# EAGLE design KMB-20 (EAGLE 8.7.1)

## Sheet 1 of 4: Avionics
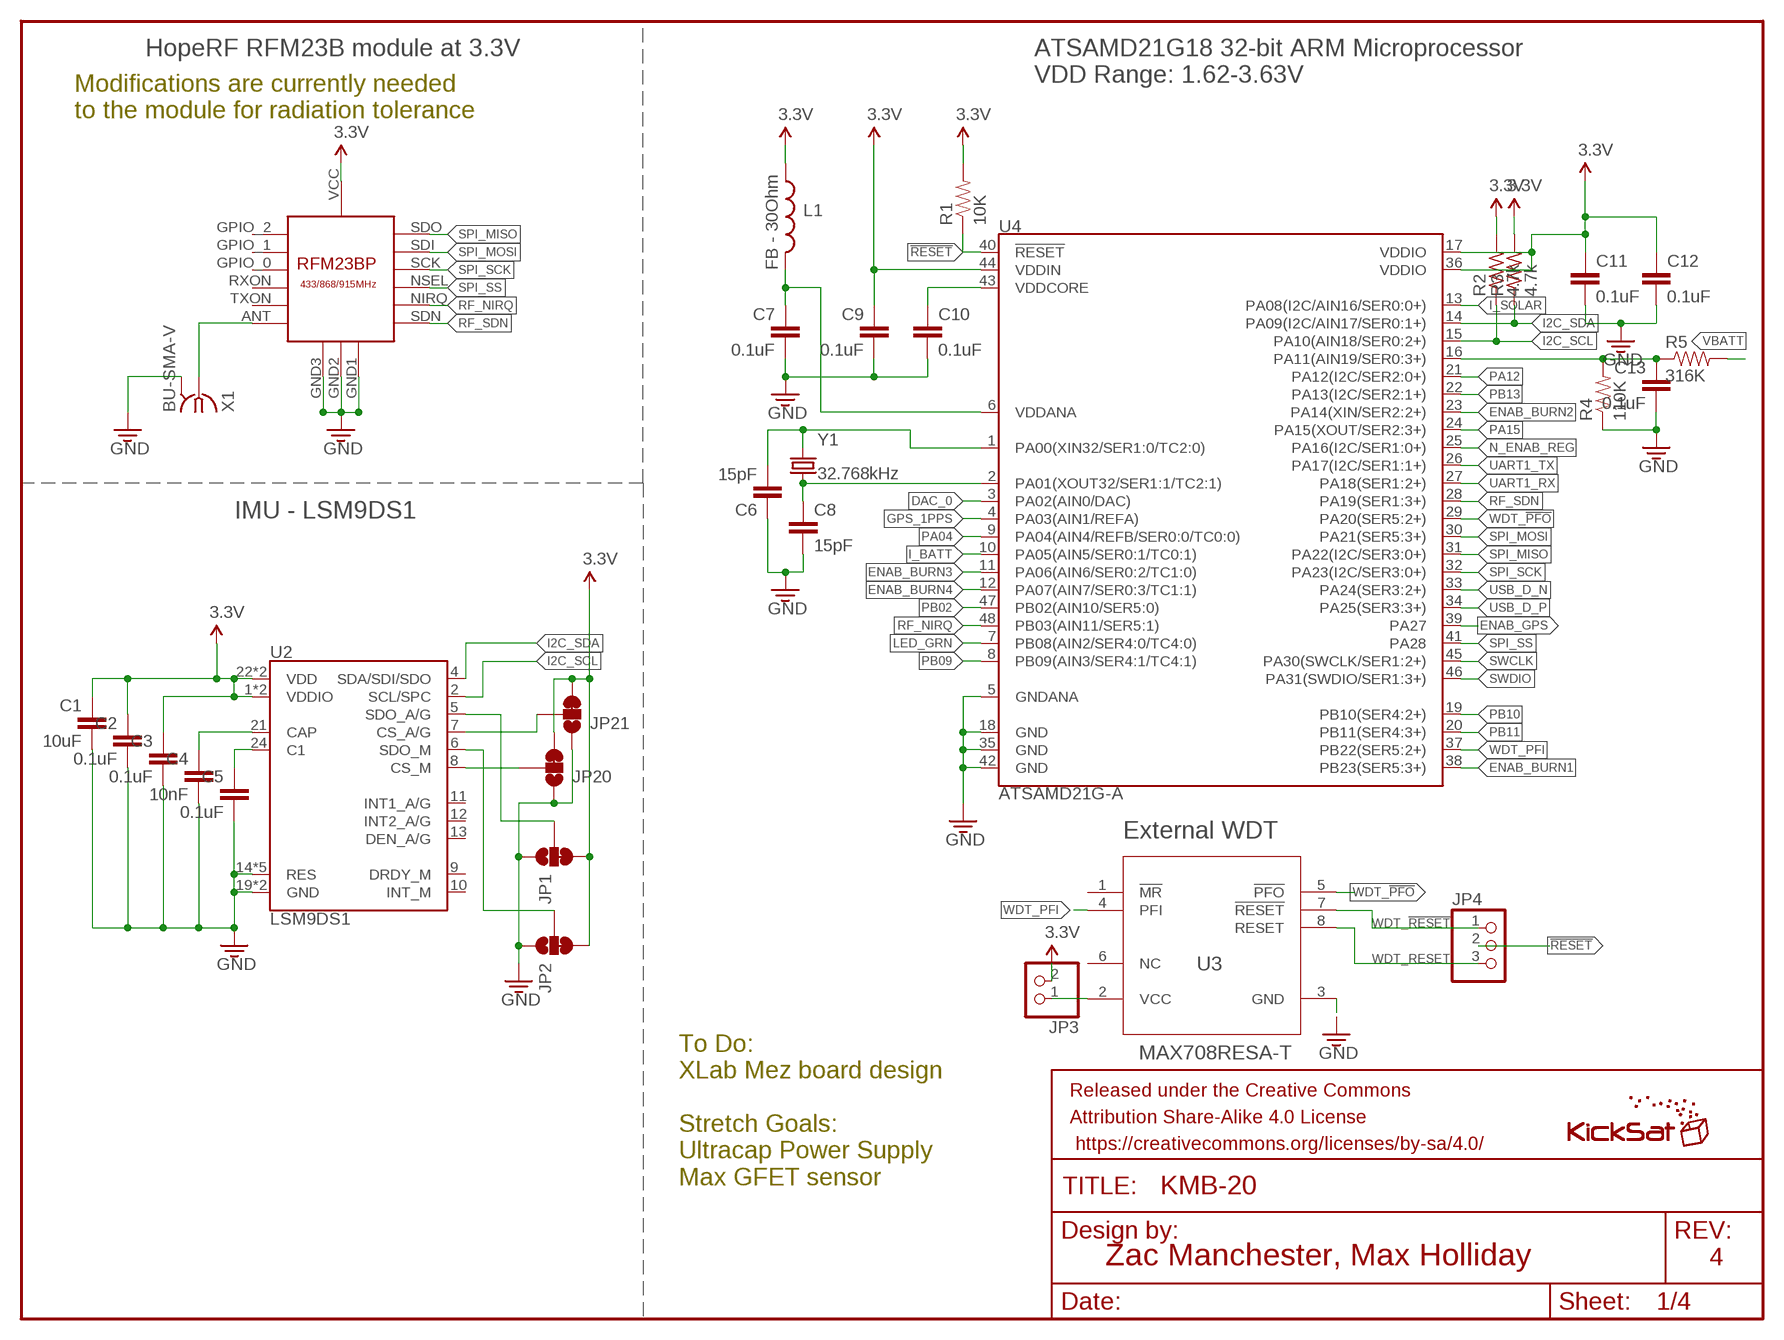
[diagram p0: schematic, sheet 1]

### Parts
C1  10uF  10UF-6.3V-20%(0603)  [0603-CAP]
C2  0.1uF  0.1UF-25V(+80/-20%)(0603)  [0603-CAP]
C3  0.1uF  0.1UF-25V(+80/-20%)(0603)  [0603-CAP]
C4  10nF  10NF/10000PF-50V-10%(0603)  [0603-CAP]
C5  0.1uF  0.1UF-25V(+80/-20%)(0603)  [0603-CAP]
C6  15pF  15PF-50V-5%(0603)  [0603-CAP@1]
C7  0.1uF  0.1UF-25V(+80/-20%)(0603)  [0603-CAP]
C8  15pF  15PF-50V-5%(0603)  [0603-CAP@1]
C9  0.1uF  0.1UF-25V(+80/-20%)(0603)  [0603-CAP]
C10  0.1uF  0.1UF-25V(+80/-20%)(0603)  [0603-CAP]
C11  0.1uF  0.1UF-25V(+80/-20%)(0603)  [0603-CAP]
C12  0.1uF  0.1UF-25V(+80/-20%)(0603)  [0603-CAP]
C13  0.1uF  0.1UF-25V(+80/-20%)(0603)  [0603-CAP]
FRAME1  FRAME-LETTER  [CREATIVE_COMMONS]
JP1  JUMPER-PAD-3-2OF3_NC_BY_TRACE_SMALL  [PAD-JUMPER-3-2OF3_NC_BY_TRACE_YES_SILK_FULL_BOX]
JP2  JUMPER-PAD-3-2OF3_NC_BY_TRACE_SMALL  [PAD-JUMPER-3-2OF3_NC_BY_TRACE_YES_SILK_FULL_BOX]
JP3  PINHD-1X2  [1X02]
JP4  PINHD-1X3  [1X03]
JP20  JUMPER-PAD-3-2OF3_NC_BY_TRACE_SMALL  [PAD-JUMPER-3-2OF3_NC_BY_TRACE_YES_SILK_FULL_BOX]
JP21  JUMPER-PAD-3-2OF3_NC_BY_TRACE_SMALL  [PAD-JUMPER-3-2OF3_NC_BY_TRACE_YES_SILK_FULL_BOX]
L1  FB - 30Ohm  INDUCTOR0603  [0603]
L2  KICKSAT_LOGO  [KICKSAT_LOGO]
R1  10K  10KOHM-1/10W-1%(0603)0603  [0603-RES]
R2  4.7k  R-US_R0603  [R0603]
R3  4.7k  R-US_R0603  [R0603]
R4  110K  10KOHM-1/10W-1%(0603)0603  [0603-RES]
R5  316K  10KOHM-1/10W-1%(0603)0603  [0603-RES]
U1  RFM23BP  [RFM23BP]
U2  LSM9DS1  [LGA24-8X4]
U3  MAX708RESA-T  [SO8]
U4  ATSAMD21G-A  [TQFP-48]
X1  BU-SMA-V  [BU-SMA-V]
Y1  32.768kHz  CRYSTAL3.2X1.5MM  [CRYSTAL-SMD-3.2X1.5MM]

### Nets
3.3V: C1.1 C2.1 C3.1 C9.1 C11.1 C12.1 JP1.3 JP2.3 JP3.2 JP20.3 JP21.3 L1.1 R1.2 R2.2 R3.2 U1.VCC U2.1(VDDIO) U2.3(VDDIO) U2.22(VDD) U2.23(VDD) U4.17(VDDIO) U4.36(VDDIO) U4.44(VDDIN) ; also sheet 2,3,4
!RESET: JP4.2 R1.1 U4.40(!RESET!) ; also sheet 3
DAC_0: U4.3(PA02(AIN0/DAC)) ; also sheet 4
ENAB_BURN1: U4.38(PB23(SER5:3+)) ; also sheet 3
ENAB_BURN2: U4.23(PA14(XIN/SER2:2+)) ; also sheet 3
ENAB_BURN3: U4.11(PA06(AIN6/SER0:2/TC1:0)) ; also sheet 3
ENAB_BURN4: U4.12(PA07(AIN7/SER0:3/TC1:1)) ; also sheet 3
ENAB_GPS: U4.39(PA27) ; also sheet 2
GND: C1.2 C2.2 C3.2 C4.2 C5.2 C6.1 C7.2 C8.2 C9.2 C10.2 C11.2 C12.2 C13.2 JP1.1 JP2.1 JP20.1 JP21.1 R4.1 U1.GND1 U1.GND2 U1.GND3 U2.14(RES) U2.15(RES) U2.16(RES) U2.17(RES) U2.18(RES) U2.19(GND) U2.20(GND) U3.3(GND) U4.5(GNDANA) U4.18(GND) U4.35(GND) U4.42(GND) X1.2 X1.3 X1.4 X1.5 ; also sheet 2,3,4
GPS_1PPS: U4.4(PA03(AIN1/REFA)) ; also sheet 4
I2C_SCL: R2.1 U2.2(SCL/SPC) U4.15(PA10(AIN18/SER0:2+)) ; also sheet 4
I2C_SDA: R3.1 U2.4(SDA/SDI/SDO) U4.14(PA09(I2C/AIN17/SER0:1+)) ; also sheet 4
I2C_SDOA/G: JP1.2 U2.5(SDO_A/G)
I_BATT: U4.10(PA05(AIN5/SER0:1/TC0:1)) ; also sheet 2
I_SOLAR: U4.13(PA08(I2C/AIN16/SER0:0+)) ; also sheet 2
LED_GRN: U4.7(PB08(AIN2/SER4:0/TC4:0)) ; also sheet 4
N$2: C4.1 U2.21(CAP)
N$6: C5.1 U2.24(C1)
N$8: JP3.1 U3.2(VCC)
N$18: C7.1 L1.2 U4.6(VDDANA)
N$19: U1.ANT X1.1
N$21: JP2.2 U2.6(SDO_M)
N$23: JP20.2 U2.8(CS_M)
N$26: JP21.2 U2.7(CS_A/G)
N$28: C6.2 U4.1(PA00(XIN32/SER1:0/TC2:0)) Y1.P$2
N$29: C8.1 U4.2(PA01(XOUT32/SER1:1/TC2:1)) Y1.P$1
N$40: C13.1 R4.2 R5.1 U4.16(PA11(AIN19/SER0:3+))
N_ENAB_REG: U4.25(PA16(I2C/SER1:0+)) ; also sheet 2
PA04: U4.9(PA04(AIN4/REFB/SER0:0/TC0:0))
PA12: U4.21(PA12(I2C/SER2:0+)) ; also sheet 4
PA15: U4.24(PA15(XOUT/SER2:3+))
PB02: U4.47(PB02(AIN10/SER5:0)) ; also sheet 4
PB09: U4.8(PB09(AIN3/SER4:1/TC4:1)) ; also sheet 4
PB10: U4.19(PB10(SER4:2+)) ; also sheet 4
PB11: U4.20(PB11(SER4:3+)) ; also sheet 4
PB13: U4.22(PA13(I2C/SER2:1+))
RF_NIRQ: U1.NIRQ U4.48(PB03(AIN11/SER5:1))
RF_SDN: U1.SDN U4.28(PA19(SER1:3+))
SPI_MISO: U1.SDO U4.31(PA22(I2C/SER3:0+))
SPI_MOSI: U1.SDI U4.30(PA21(SER5:3+))
SPI_SCK: U1.SCK U4.32(PA23(I2C/SER3:0+))
SPI_SS: U1.NSEL U4.41(PA28)
SWCLK: U4.45(PA30(SWCLK/SER1:2+)) ; also sheet 3
SWDIO: U4.46(PA31(SWDIO/SER1:3+)) ; also sheet 3
UART1_RX: U4.27(PA18(SER1:2+)) ; also sheet 4
UART1_TX: U4.26(PA17(I2C/SER1:1+)) ; also sheet 4
USB_D_N: U4.33(PA24(SER3:2+)) ; also sheet 3
USB_D_P: U4.34(PA25(SER3:3+)) ; also sheet 3
VBATT: R5.2 ; also sheet 2,3
VDDCORE3: C10.1 U4.43(VDDCORE)
WDT_!PFO: U3.5(!PFO) U4.29(PA20(SER5:2+))
WDT_!RESET: JP4.1 U3.7(!RESET)
WDT_PFI: U3.4(PFI) U4.37(PB22(SER5:2+))
WDT_RESET: JP4.3 U3.8(RESET)
Unconnected: U1.GPIO_0 U1.GPIO_1 U1.GPIO_2 U1.RXON U1.TXON U2.9(DRDY_M) U2.10(INT_M) U2.11(INT1_A/G) U2.12(INT2_A/G) U2.13(DEN_A/G) U3.1(!MR) U3.6(NC)

### Notes on the sheet
- HopeRF RFM23B module at 3.3V
- ATSAMD21G18 32-bit ARM Microprocessor 
  VDD Range: 1.62-3.63V
- Modifications are currently needed
  to the module for radiation tolerance
- IMU - LSM9DS1
- External WDT
- To Do:
  XLab Mez board design
  
  Stretch Goals:
  Ultracap Power Supply
  Max GFET sensor
- Zac Manchester, Max Holliday | 4

## Sheet 2 of 4: Power
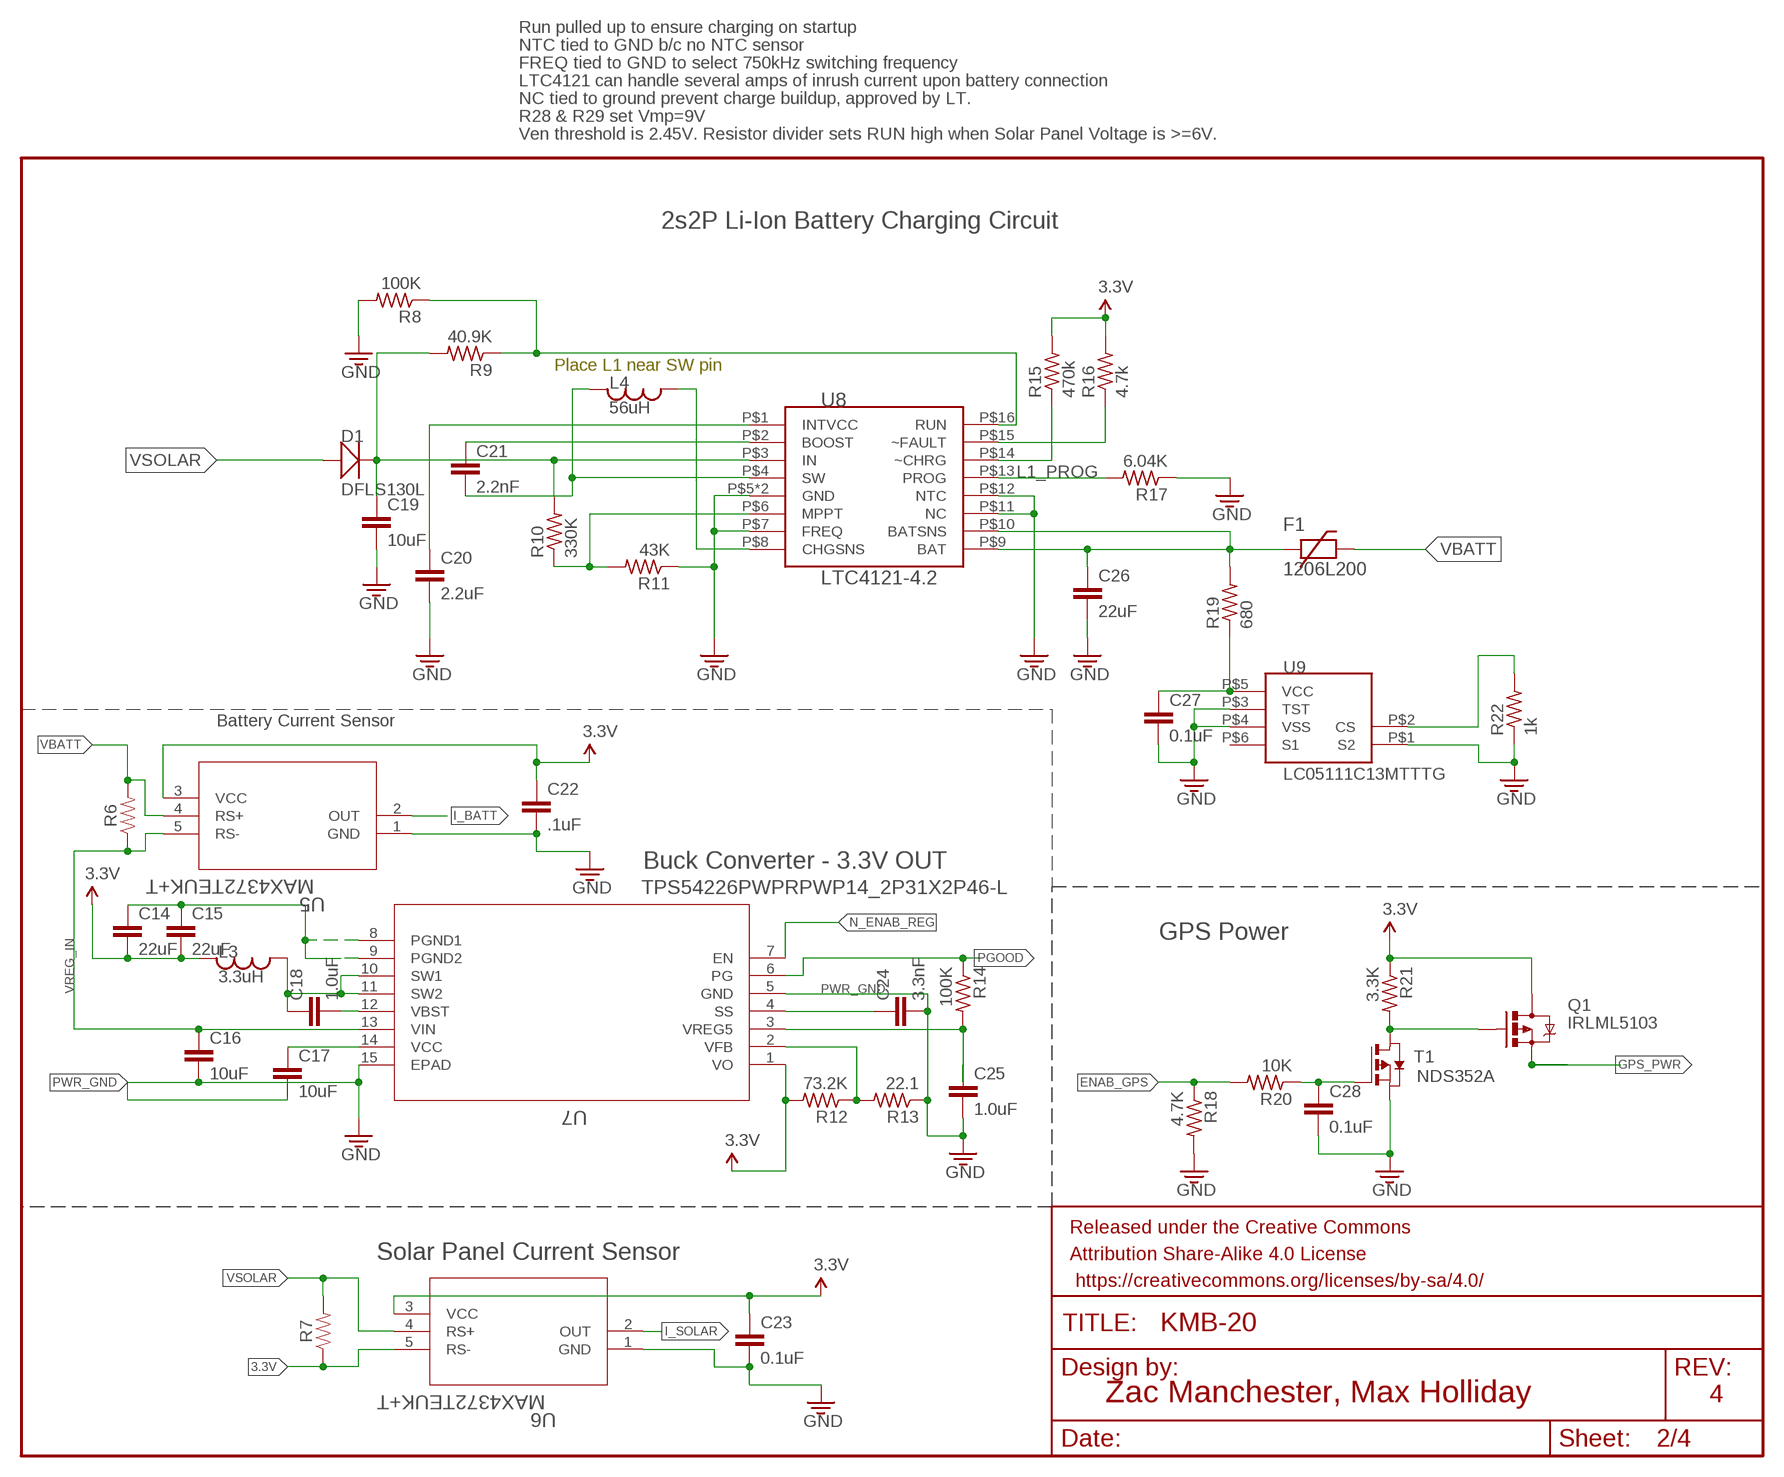
[diagram p1: schematic, sheet 2]

### Parts
C14  22uF  22UF-0805-6.3V-20%  [0805]
C15  22uF  22UF-0805-6.3V-20%  [0805]
C16  10uF  10UF-0603-6.3V-20%  [0603]
C17  10uF  10UF-0603-6.3V-20%  [0603]
C18  1.0uF  1.0UF-0603-16V-10%  [0603]
C19  10uF  10UF-0603-6.3V-20%  [0603]
C20  2.2uF  2.2UF-0603-10V-20%  [0603]
C21  2.2nF  2.2NF/2200PF-0603-50V-10%  [0603]
C22  .1uF  CAP0603-CAP  [0603-CAP@1]
C23  0.1uF  0.1UF-0603-25V-5%  [0603]
C24  3.3nF  3.3NF-0603-100V-10%  [0603]
C25  1.0uF  1.0UF-0603-16V-10%  [0603]
C26  22uF  0.1UF-0603-25V-5%  [0603]
C27  0.1uF  0.1UF-0603-25V-5%  [0603]
C28  0.1uF  0.1UF-0603-25V-5%  [0603]
D1  DFLS130L  [PWRDI-123]
F1  1206L200  PTCFUSE1206  [1206]
FRAME2  FRAME-LETTER  [CREATIVE_COMMONS]
L3  3.3uH  IND1812  [1812]
L4  56uH  IND1812  [1812]
Q1  IRLML5103  MOSFET-PCHANNEL  [SOT23-3]
R6  RESISTOR0603  [0603]
R7  RESISTOR0603  [0603]
R8  100K  R-US_R0603  [R0603]
R9  40.9K  R-US_R0603  [R0603]
R10  330K  R-US_R0603  [R0603]
R11  43K  R-US_R0603  [R0603]
R12  73.2K  R-US_R0603  [R0603]
R13  22.1  R-US_R0603  [R0603]
R14  100K  R-US_R0603  [R0603]
R15  470k  R-US_R0603  [R0603]
R16  4.7k  R-US_R0603  [R0603]
R17  6.04K  R-US_R0603  [R0603]
R18  4.7K  R-US_R0603  [R0603]
R19  680  R-US_R0603  [R0603]
R20  10K  R-US_R0603  [R0603]
R21  3.3K  R-US_R0603  [R0603]
R22  1k  R-US_R0603  [R0603]
T1  NDS352A  PMOSSOT23  [SOT-23]
U5  MAX4372TEUK+T  [21-0057F]
U6  MAX4372TEUK+T  [21-0057F]
U7  TPS54226PWPRPWP14_2P31X2P46-L  [PWP14_2P31X2P46-L]
U8  LTC4121-4.2  [QFN-16-PAD]
U9  LC05111C13MTTTG  [WDFN6]

### Nets
3.3V: C14.2 C15.2 C22.1 C23.1 L3.P$1 Q1.3(D) R7.1 R12.2 R15.2 R16.2 R21.1 U5.3(VCC) U6.3(VCC) U6.5(RS-) U7.1(VO) ; also sheet 1,3,4
ENAB_GPS: R18.1 R20.2 ; also sheet 1
GND: C19.2 C20.2 C22.2 C23.2 C26.2 C27.2 C28.2 R8.2 R11.1 R17.1 R18.2 R22.1 T1.2(S) U5.1(GND) U6.1(GND) U8.P$5(GND) U8.P$7(FREQ) U8.P$11(NC) U8.P$12(NTC) U8.P$17(GND) U9.P$1(S2) U9.P$3(TST) U9.P$4(VSS) ; also sheet 1,3,4
GPS_PWR: Q1.2(S) ; also sheet 4
I_BATT: U5.2(OUT) ; also sheet 1
I_SOLAR: U6.2(OUT) ; also sheet 1
L1_CHG: R8.1 R9.1 U8.P$16(RUN)
L1_FAULTN: R16.1 U8.P$15(~FAULT)
L1_PROG: R17.2 U8.P$13(PROG)
LION1: C26.1 F1.1 R19.2 U8.P$9(BAT) U8.P$10(BATSNS)
N$3: C18.1 L3.P$2 U7.10(SW1) U7.11(SW2)
N$10: C28.1 R20.1 T1.3(G)
N$12: Q1.1(G) R21.2 T1.1(D)
N$14: C18.2 U7.12(VBST)
N$32: C21.2 L4.P$1 U8.P$4(SW)
N$33: C21.1 U8.P$2(BOOST)
N$34: C20.1 U8.P$1(INTVCC)
N$35: R10.1 R11.2 U8.P$6(MPPT)
N$36: L4.P$2 U8.P$8(CHGSNS)
N$37: R15.1 U8.P$14(~CHRG)
N$41: C27.1 R19.1 U9.P$5(VCC)
N$42: C17.1 U7.14(VCC)
N$45: R22.2 U9.P$2(CS)
N$46: C25.1 R14.2 U7.3(VREG5)
N$51: C24.1 U7.4(SS)
N$52: R12.1 R13.2 U7.2(VFB)
N_ENAB_REG: U7.7(EN) ; also sheet 1
PGOOD: R14.1 U7.6(PG)
PWR_GND: C14.1 C15.1 C16.2 C17.2 C24.2 C25.2 R13.1 U7.5(GND) U7.8(PGND1) U7.9(PGND2) U7.15(EPAD) ; supply symbol labelled GND
VBATT: F1.2 R6.2 U5.4(RS+) ; also sheet 1,3
VREG_IN: C16.1 R6.1 U5.5(RS-) U7.13(VIN)
VSOLAR: D1.A R7.2 U6.4(RS+) ; also sheet 3
VSOLAR_IN: C19.1 D1.C R9.2 R10.2 U8.P$3(IN)
Unconnected: U9.P$6(S1)

### Notes on the sheet
- Run pulled up to ensure charging on startup
- NTC tied to GND b/c no NTC sensor
- FREQ tied to GND to select 750kHz switching frequency
- LTC4121 can handle several amps of inrush current upon battery connection
- NC tied to ground prevent charge buildup, approved by LT.
- R28 & R29 set Vmp=9V
- Ven threshold is 2.45V. Resistor divider sets RUN high when Solar Panel Voltage is >=6V.
- 2s2P Li-Ion Battery Charging Circuit
- Place L1 near SW pin
- Battery Current Sensor
- Buck Converter - 3.3V OUT
- GPS Power
- Solar Panel Current Sensor
- Zac Manchester, Max Holliday | 4

## Sheet 3 of 4: Connectors
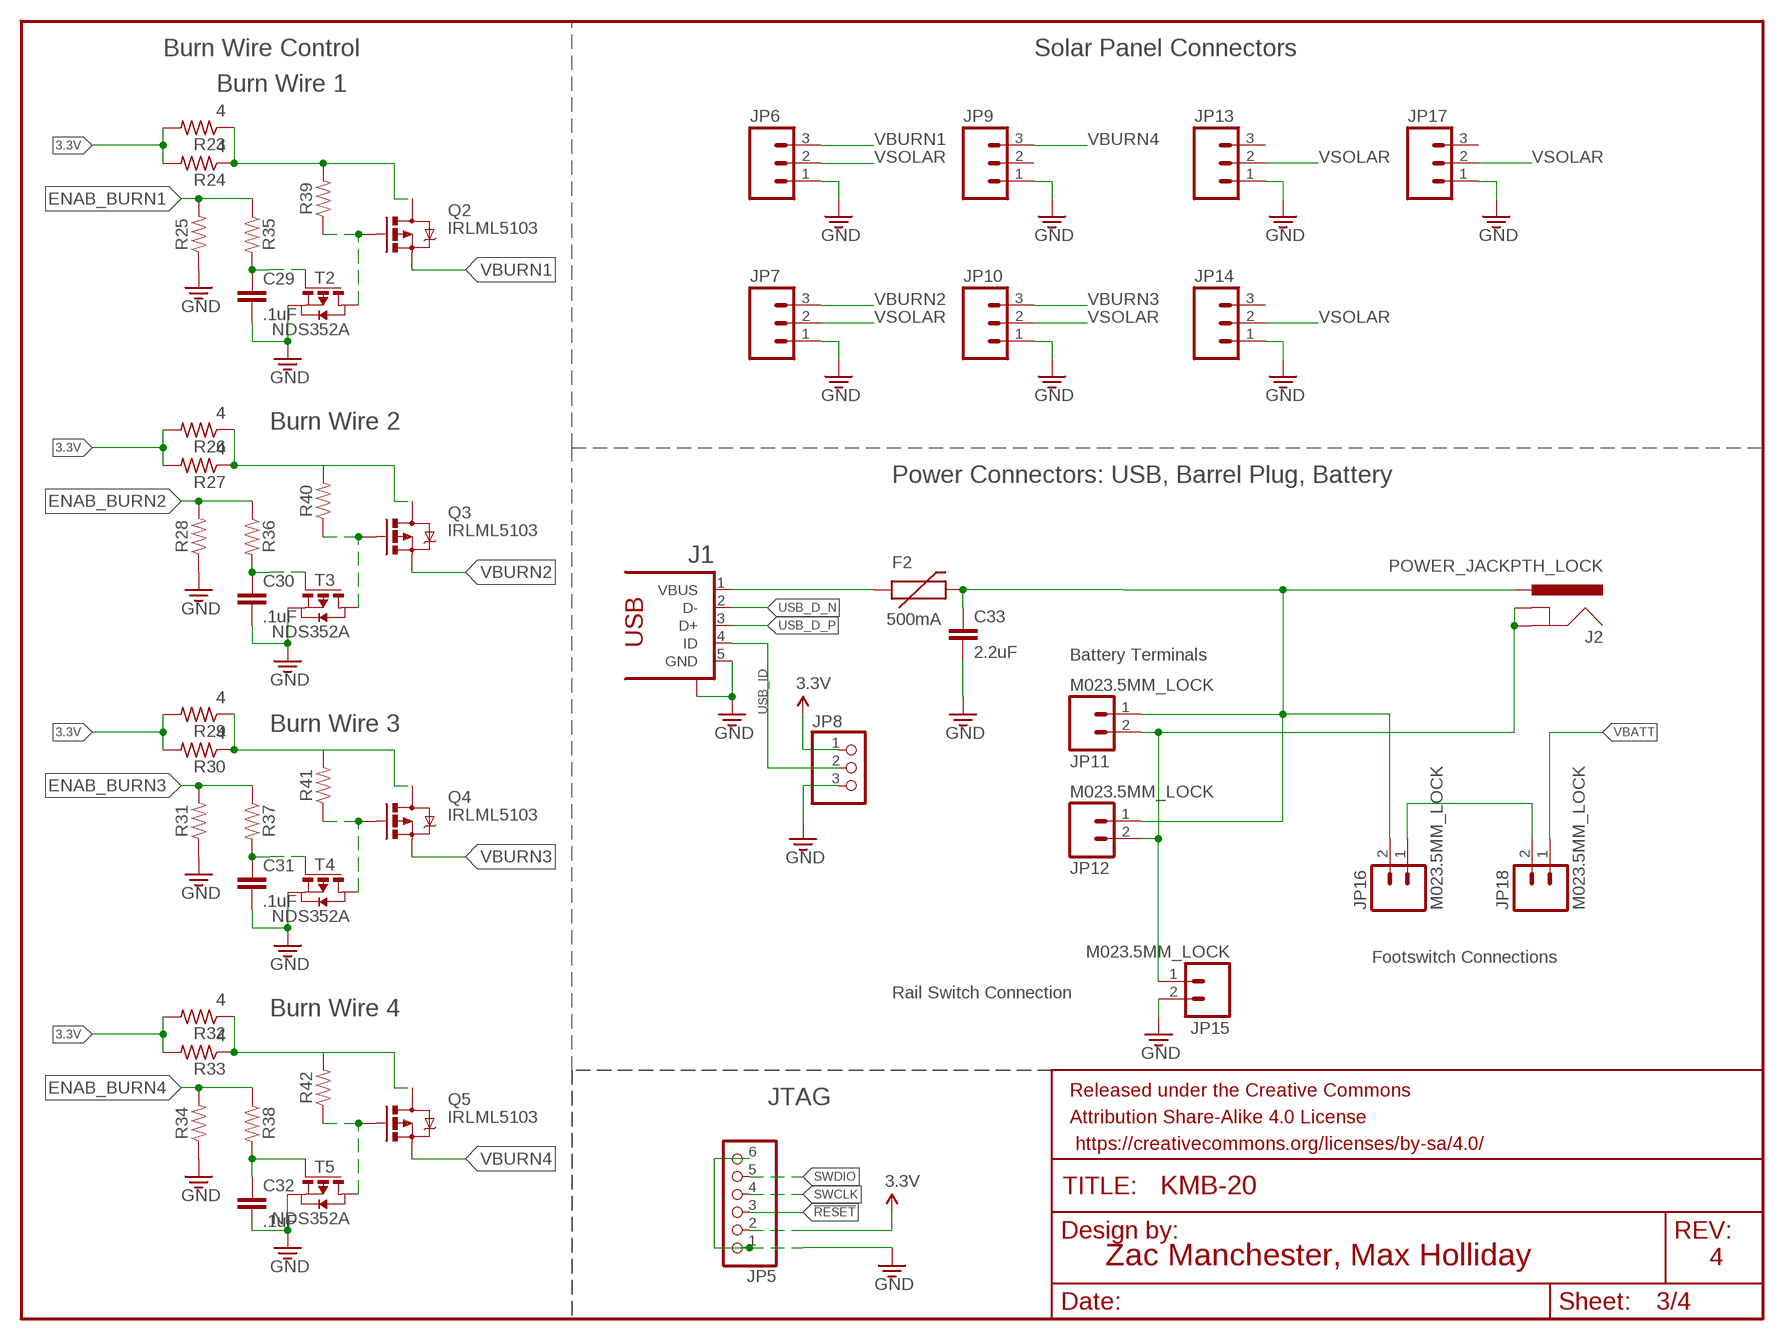
[diagram p2: schematic, sheet 3]

### Parts
C29  .1uF  CAP0603-CAP  [0603-CAP@1]
C30  .1uF  CAP0603-CAP  [0603-CAP@1]
C31  .1uF  CAP0603-CAP  [0603-CAP@1]
C32  .1uF  CAP0603-CAP  [0603-CAP@1]
C33  2.2uF  2.2UF-0603-10V-20%  [0603]
F2  500mA  PTCSMD  [PTC-1206]
FRAME3  FRAME-LETTER  [CREATIVE_COMMONS]
J1  1981584-1  [1981584-1]
J2  POWER_JACKPTH_LOCK  [POWER_JACK_PTH_LOCK]
JP5  PINHD-1X6  [1X06]
JP6  M03POLAR_LOCK  [MOLEX-1X3_LOCK]
JP7  M03POLAR_LOCK  [MOLEX-1X3_LOCK]
JP8  PINHD-1X3  [1X03]
JP9  M03POLAR_LOCK  [MOLEX-1X3_LOCK]
JP10  M03POLAR_LOCK  [MOLEX-1X3_LOCK]
JP11  M023.5MM_LOCK  [SCREWTERMINAL-3.5MM-2_LOCK]
JP12  M023.5MM_LOCK  [SCREWTERMINAL-3.5MM-2_LOCK]
JP13  M03POLAR_LOCK  [MOLEX-1X3_LOCK]
JP14  M03POLAR_LOCK  [MOLEX-1X3_LOCK]
JP15  M023.5MM_LOCK  [SCREWTERMINAL-3.5MM-2_LOCK]
JP16  M023.5MM_LOCK  [SCREWTERMINAL-3.5MM-2_LOCK]
JP17  M03POLAR_LOCK  [MOLEX-1X3_LOCK]
JP18  M023.5MM_LOCK  [SCREWTERMINAL-3.5MM-2_LOCK]
Q2  IRLML5103  MOSFET-PCHANNEL  [SOT23-3]
Q3  IRLML5103  MOSFET-PCHANNEL  [SOT23-3]
Q4  IRLML5103  MOSFET-PCHANNEL  [SOT23-3]
Q5  IRLML5103  MOSFET-PCHANNEL  [SOT23-3]
R23  4  R-US_R0603  [R0603]
R24  4  R-US_R0603  [R0603]
R25  RESISTOR0603  [0603]
R26  4  R-US_R0603  [R0603]
R27  4  R-US_R0603  [R0603]
R28  RESISTOR0603  [0603]
R29  4  R-US_R0603  [R0603]
R30  4  R-US_R0603  [R0603]
R31  RESISTOR0603  [0603]
R32  4  R-US_R0603  [R0603]
R33  4  R-US_R0603  [R0603]
R34  RESISTOR0603  [0603]
R35  RESISTOR0603  [0603]
R36  RESISTOR0603  [0603]
R37  RESISTOR0603  [0603]
R38  RESISTOR0603  [0603]
R39  RESISTOR0603  [0603]
R40  RESISTOR0603  [0603]
R41  RESISTOR0603  [0603]
R42  RESISTOR0603  [0603]
T2  NDS352A  PMOSSOT23  [SOT-23]
T3  NDS352A  PMOSSOT23  [SOT-23]
T4  NDS352A  PMOSSOT23  [SOT-23]
T5  NDS352A  PMOSSOT23  [SOT-23]

### Nets
3.3V: JP5.2 JP8.1 R23.2 R24.2 R26.2 R27.2 R29.2 R30.2 R32.2 R33.2 ; also sheet 1,2,4
!RESET: JP5.3 ; also sheet 1
ENAB_BURN1: R25.2 R35.1 ; also sheet 1
ENAB_BURN2: R28.2 R36.1 ; also sheet 1
ENAB_BURN3: R31.2 R37.1 ; also sheet 1
ENAB_BURN4: R34.2 R38.1 ; also sheet 1
GND: C29.2 C30.2 C31.2 C32.2 C33.2 J1.5(GND) J1.S1 JP5.1 JP5.6 JP6.1 JP7.1 JP8.3 JP9.1 JP10.1 JP13.1 JP14.1 JP15.2 JP17.1 R25.1 R28.1 R31.1 R34.1 T2.2(S) T3.2(S) T4.2(S) T5.2(S) ; also sheet 1,2,4
N$4: JP16.1 JP18.2
N$5: C30.1 R36.2 T3.3(G)
N$7: Q2.1(G) R39.1 T2.1(D)
N$11: C31.1 R37.2 T4.3(G)
N$13: F2.1 J1.1(VBUS)
N$15: Q3.1(G) R40.1 T3.1(D)
N$22: J2.GND J2.GNDBREAK JP11.2 JP12.2 JP15.1
N$25: C29.1 R35.2 T2.3(G)
N$38: C32.1 R38.2 T5.3(G)
N$44: Q4.1(G) R41.1 T4.1(D)
N$47: Q5.1(G) R42.1 T5.1(D)
SWCLK: JP5.4 ; also sheet 1
SWDIO: JP5.5 ; also sheet 1
USB_D_N: J1.2(D-) ; also sheet 1
USB_D_P: J1.3(D+) ; also sheet 1
USB_ID: J1.4(ID) JP8.2
VBATT: C33.1 F2.2 J2.PWR JP11.1 JP12.1 JP16.2 JP18.1 ; also sheet 1,2
VBURN1: JP6.3 Q2.2(S)
VBURN2: JP7.3 Q3.2(S)
VBURN3: JP10.3 Q4.2(S)
VBURN4: JP9.3 Q5.2(S)
VBURN_IN: Q2.3(D) Q3.3(D) Q4.3(D) Q5.3(D) R23.1 R24.1 R26.1 R27.1 R29.1 R30.1 R32.1 R33.1 R39.2 R40.2 R41.2 R42.2
VSOLAR: JP6.2 JP7.2 JP10.2 JP13.2 JP14.2 JP17.2 ; also sheet 2
Unconnected: JP9.2 JP13.3 JP14.3 JP17.3

### Notes on the sheet
- Burn Wire Control | Solar Panel Connectors
- Burn Wire 1
- Burn Wire 2
- Power Connectors: USB, Barrel Plug, Battery
- Battery Terminals
- Burn Wire 3
- Footswitch Connections
- Rail Switch Connection
- Burn Wire 4
- JTAG
- Zac Manchester, Max Holliday | 4

## Sheet 4 of 4: RF and GPS
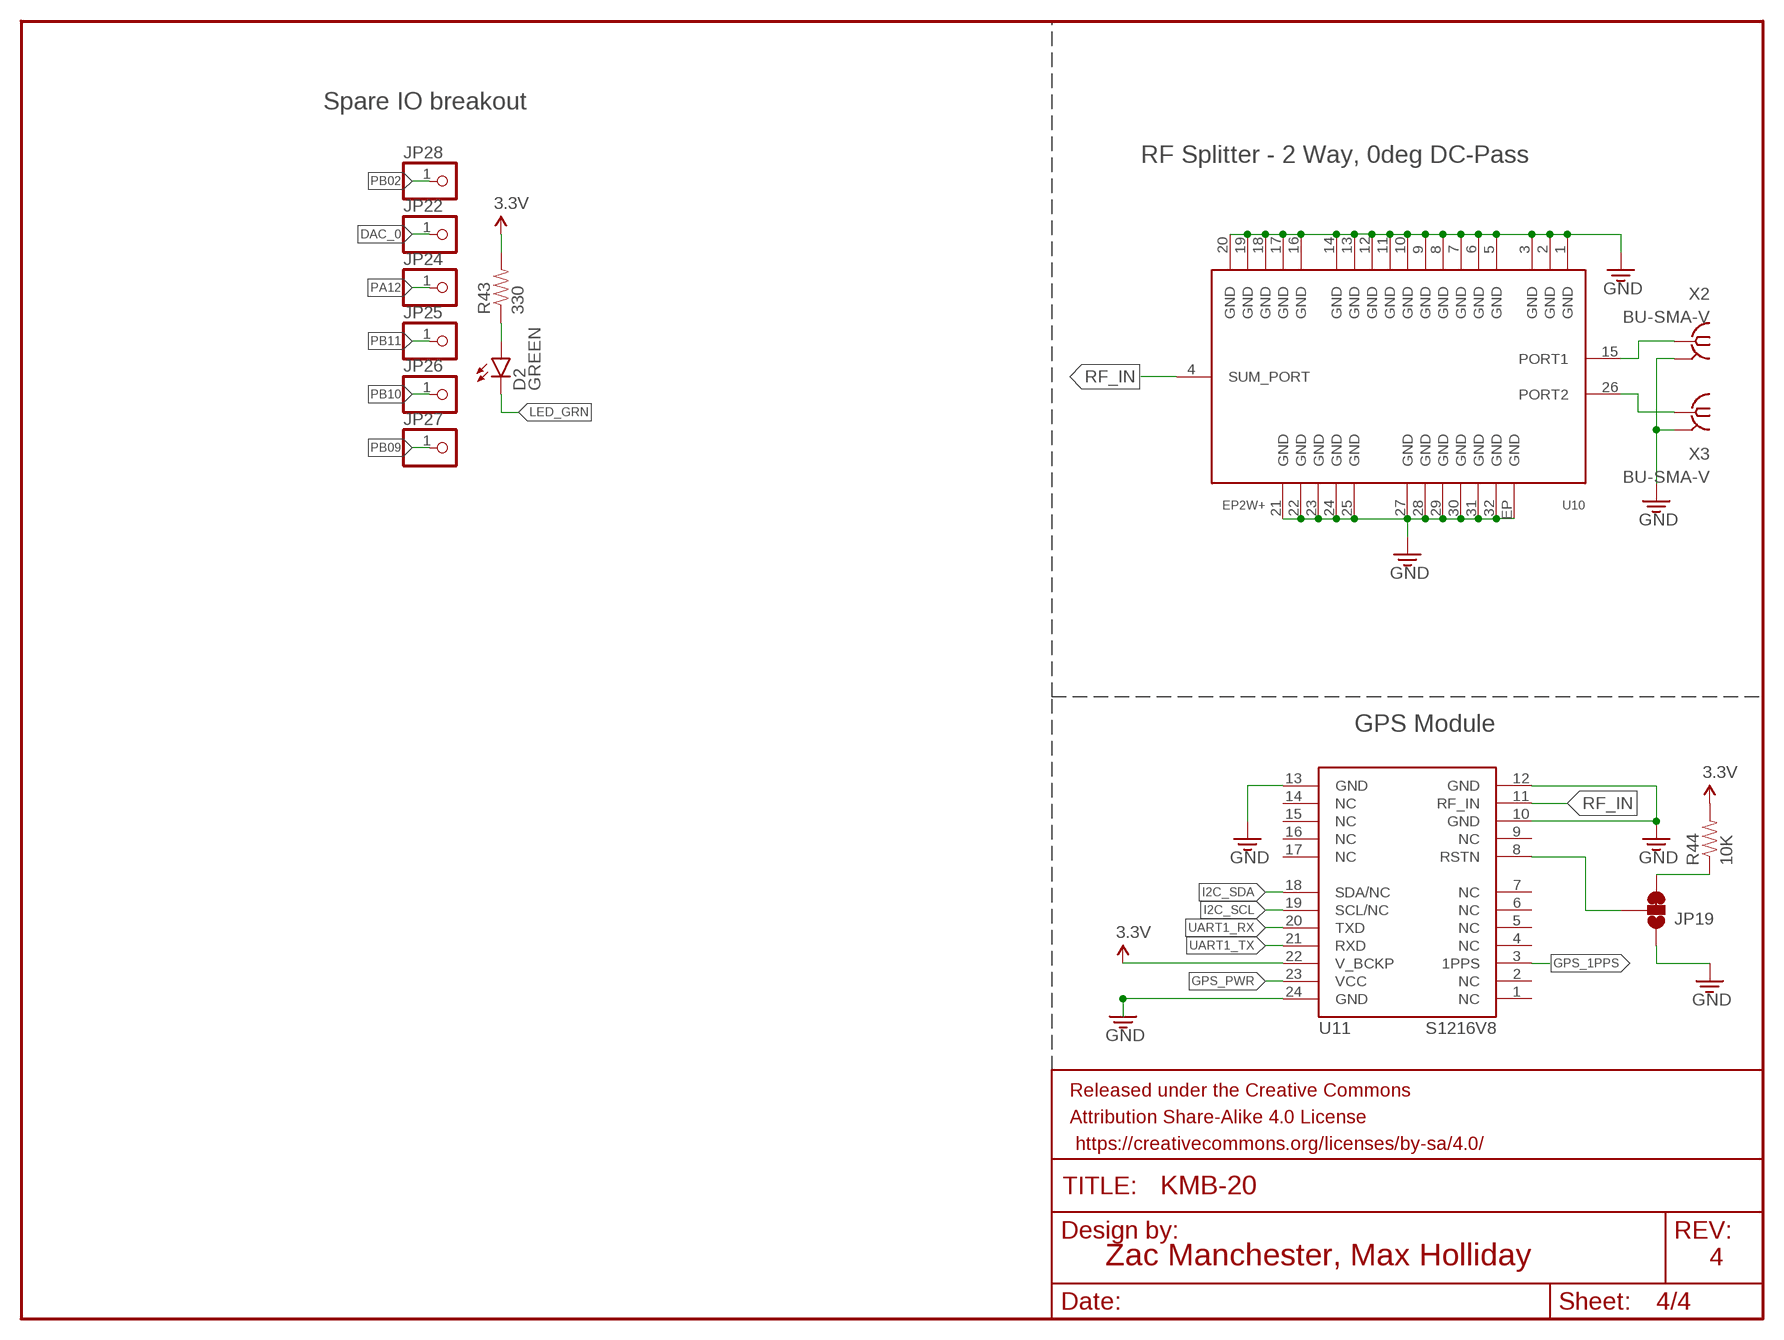
[diagram p3: schematic, sheet 4]

### Parts
D2  GREEN  LED-GREEN0603  [LED-0603]
FRAME4  FRAME-LETTER  [CREATIVE_COMMONS]
JP19  JUMPER-PAD-3-2OF3_NC_BY_TRACE_SMALL  [PAD-JUMPER-3-2OF3_NC_BY_TRACE_YES_SILK_FULL_BOX]
JP22  PINHD-1X1  [1X01]
JP24  PINHD-1X1  [1X01]
JP25  PINHD-1X1  [1X01]
JP26  PINHD-1X1  [1X01]
JP27  PINHD-1X1  [1X01]
JP28  PINHD-1X1  [1X01]
R43  330  330OHM1/10W1%(0603)  [0603-RES]
R44  10K  10KOHM-1/10W-1%(0603)0603  [0603-RES]
U10  EP2W+  [QFN32-5X5MM]
U11  S1216V8  [S1216_24PIN_PACKAGE]
X2  BU-SMA-V  [BU-SMA-V]
X3  BU-SMA-V  [BU-SMA-V]

### Nets
3.3V: R43.2 R44.2 U11.22(V_BCKP) ; also sheet 1,2,3
DAC_0: JP22.1 ; also sheet 1
GND: JP19.1 U10.1(GND) U10.2(GND) U10.3(GND) U10.5(GND) U10.6(GND) U10.7(GND) U10.8(GND) U10.9(GND) U10.10(GND) U10.11(GND) U10.12(GND) U10.13(GND) U10.14(GND) U10.16(GND) U10.17(GND) U10.18(GND) U10.19(GND) U10.20(GND) U10.21(GND) U10.22(GND) U10.23(GND) U10.24(GND) U10.25(GND) U10.27(GND) U10.28(GND) U10.29(GND) U10.30(GND) U10.31(GND) U10.32(GND) U10.EP(GND) U11.10(GND) U11.12(GND) U11.13(GND) U11.24(GND) X2.2 X2.3 X2.4 X2.5 X3.2 X3.3 X3.4 X3.5 ; also sheet 1,2,3
GPS_1PPS: U11.3(1PPS) ; also sheet 1
GPS_PWR: U11.23(VCC) ; also sheet 2
I2C_SCL: U11.19(SCL/NC) ; also sheet 1
I2C_SDA: U11.18(SDA/NC) ; also sheet 1
LED_GRN: D2.C ; also sheet 1
N$1: D2.A R43.1
N$9: JP19.2 U11.8(RSTN)
N$16: U10.15(PORT1) X2.1
N$17: U10.26(PORT2) X3.1
N$24: JP19.3 R44.1
PA12: JP24.1 ; also sheet 1
PB02: JP28.1 ; also sheet 1
PB09: JP27.1 ; also sheet 1
PB10: JP26.1 ; also sheet 1
PB11: JP25.1 ; also sheet 1
RF_IN: U10.4(SUM_PORT) U11.11(RF_IN)
UART1_RX: U11.20(TXD) ; also sheet 1
UART1_TX: U11.21(RXD) ; also sheet 1
Unconnected: U11.1(NC) U11.2(NC) U11.4(NC) U11.5(NC) U11.6(NC) U11.7(NC) U11.9(NC) U11.14(NC) U11.15(NC) U11.16(NC) U11.17(NC)

### Notes on the sheet
- Spare IO breakout
- RF Splitter - 2 Way, 0deg DC-Pass
- GPS Module
- Zac Manchester, Max Holliday | 4

## Library data of the parts
C1 = SparkFun-Capacitors:10UF-6.3V-20%(0603): CAP-11015; PROD_ID: CAP-11015
C2 C3 C5 C7 C9-C13 = SparkFun-Capacitors:0.1UF-25V(+80/-20%)(0603): CAP-00810 Ceramic Standard decoupling cap; PROD_ID: CAP-00810
C4 = SparkFun-Capacitors:10NF/10000PF-50V-10%(0603): CAP-00867; PROD_ID: CAP-00867
C6 C8 = SparkFun-Capacitors:15PF-50V-5%(0603): CAP-07881; PROD_ID: CAP-07881
C14 C15 = SparkFun-Capacitors:22UF: 22µF ceramic capacitors A capacitor is a passive two-terminal electrical component used to store electrical energy temporarily in an electric field.; PROD_ID: CAP-08402
C16 C17 C19 = SparkFun-Capacitors:10UF: 10.0µF ceramic capacitors A capacitor is a passive two-terminal electrical component used to store electrical energy temporarily in an electric field.; PROD_ID: CAP-11015
C18 C25 = SparkFun-Capacitors:1.0UF: 1µF ceramic capacitors A capacitor is a passive two-terminal electrical component used to store electrical energy temporarily in an electric field.; PROD_ID: CAP-00868
C20 C33 = SparkFun-Capacitors:2.2UF: 2.2µF ceramic capacitors A capacitor is a passive two-terminal electrical component used to store electrical energy temporarily in an electric field.; PROD_ID: CAP-07888
C21 = SparkFun-Capacitors:2.2NF/2200PF: 2.2nF/2,200pF ceramic capacitors A capacitor is a passive two-terminal electrical component used to store electrical energy temporarily in an electric field.; PROD_ID: CAP-07877
C22 C29-C32 = SparkFun-Capacitors:CAP: Capacitor Standard 0603 ceramic capacitor, and 0.1" leaded capacitor.
C23 C27 C28 = SparkFun-Capacitors:0.1UF: 0.1µF ceramic capacitors A capacitor is a passive two-terminal electrical component used to store electrical energy temporarily in an electric field.; PROD_ID: CAP-08604
C24 = SparkFun-Capacitors:3.3NF: 3.3nF ceramic capacitors A capacitor is a passive two-terminal electrical component used to store electrical energy temporarily in an electric field.; PROD_ID: CAP-09633
C26 = SparkFun-Capacitors:0.1UF: 0.1µF ceramic capacitors A capacitor is a passive two-terminal electrical component used to store electrical energy temporarily in an electric field.; PROD_ID: CAP-08604; VALUE: 0.1uF
D1 = BrownSpaceEngineering:DFLS130L
D2 = SparkFun-LED:LED-GREEN: Various green LEDs Green LEDs used in SFE Production 0603- DIO-00821 LARGE- DIO-00862 LILYPAD- DIO-09910; PROD_ID: DIO-00821
F1 = BrownSpaceEngineering:PTCFUSE: PTC Fuse
F2 = SparkFun-PowerIC:PTC: Resettable Fuse PTC Resettable Fuse. Spark Fun Electronics SKU : COM-08357; PROD_ID: RES-11150
FRAME1 FRAME2 FRAME4 = SparkFun-Aesthetics:FRAME-LETTER: Schematic Frame - Letter Standard 8.5x11 US Letter frame
FRAME3 = SparkFun-Aesthetics:FRAME-LETTER: Schematic Frame Standard 8.5x11 US Letter frame
J1 = audio amplifier example:1981584-1: Receptacle, micro-USB, type A/B Tyco Electronics
J2 = SparkFun-Connectors:POWER_JACK: Power Jack Connector This is the standard 5.5mm barrel jack for power. The PTH is the most common, proven, reliable, footprint. The Slot footprint only works if the mill layer is transmitted to the PCB fab house so be warned. Here are the connectors we sell at SparkFun: DC Barrel Power Jack/Connector <https://www.sparkfun.com/products/119> (PRT-00119) DC Barrel Power Jack/Connector (SMD) <https://www.sparkfun.com/products/12748> (PRT-12748) DC Barrel Jack Adapter - Breadboard Compatible <https://www.sparkfun.com/products/10811> (PRT-10811) It is used on this SparkFun product (and many, many others): SparkFun RedBoard - Programmed with Arduino <https://www.sparkfun.com/products/12757> (DEV-12757) Also, if you need a mating power supply or connector, please check these out: Wall Adapter Power Supply - 9VDC 650mA <https://www.sparkfun.com/products/298> (TOL-00298) DC Barrel Jack Adapter - Male <https://www.sparkfun.com/products/10287> (PRT-10287); PROD_ID: CONN-08197; SF_ID: PRT-00119
JP1 JP2 JP19-JP21 = SparkFun-Passives:JUMPER-PAD-3-2OF3_NC_BY_TRACE
JP3 = pinhead:PINHD-1X2: PIN HEADER
JP4 JP8 = pinhead:PINHD-1X3: PIN HEADER
JP5 = pinhead:PINHD-1X6: PIN HEADER
JP6 JP7 JP9 JP10 JP13 JP14 JP17 = SparkFun-Connectors:M03: Header 3 Standard 3-pin 0.1" header. Use with straight break away headers (SKU : PRT-00116), right angle break away headers (PRT-00553), swiss pins (PRT-00743), machine pins (PRT-00117), and female headers (PRT-00115). Molex polarized connector foot print use with SKU : PRT-08232 with associated crimp pins and housings.
JP11 JP12 JP15 JP16 JP18 = SparkFun-Connectors:M02: Standard 2-pin 0.1" header. Use with - straight break away headers ( PRT-00116) - right angle break away headers (PRT-00553) - swiss pins (PRT-00743) - machine pins (PRT-00117) - female headers (PRT-00115) Molex polarized connector foot print use with: PRT-08233 with associated crimp pins and housings. 2.54_SCREWTERM for use with PRT-10571. 3.5mm Screw Terminal footprints for PRT-08084 5mm Screw Terminal footprints for use with PRT-08432; PROD_ID: CONN-08399
JP22 JP24-JP28 = pinhead:PINHD-1X1: PIN HEADER
L1 = SparkFun-Passives:INDUCTOR: Inductors Basic Inductor/Choke - 0603 and 1206. Footprints are not proven and vary greatly between part numbers. INDUCTOR POWER 3.3UH 4.0A SMD 0.197" L x 0.197" W x 0.177" H (5.00mm x 5.00mm x 4.50mm); PROD_ID: RES-07859
L2 = KickSat-Logo:KICKSAT_LOGO
L3 L4 = BrownSpaceEngineering:IND
Q1-Q5 = User-Submitted:MOSFET-PCHANNEL: Generic PMOSFET IRLML2244 - TRANS-11153 (SOT-23 -20V -4.3A) (1.Gate 2.Source 3.Drain) FQP27P06 - COM-10349 <http://www.sparkfun.com/products/10349> (TO-220 -60V -27A) (1.Gate 2.Source 3.Drain); PROD_ID: TRANS-08285
R1 R44 = SparkFun-Resistors:10KOHM-1/10W-1%(0603): RES-00824; PROD_ID: RES-00824
R2 R3 R8-R24 R26 R27 R29 R30 R32 R33 = resistor:R-US_: RESISTOR, American symbol
R4 R5 = SparkFun-Resistors:10KOHM-1/10W-1%(0603): RES-00824; PROD_ID: RES-00824; VALUE: 10K
R6 R7 R25 R28 R31 R34-R42 = SparkFun-Resistors:RESISTOR: Generic Resistor Package
R43 = SparkFun-Resistors:330OHM1/10W1%(0603): RES-00818; PROD_ID: RES-00818
T1-T5 = zetex:PMOSSOT23: MOS FET; OC_FARNELL: unknown; OC_NEWARK: unknown
U1 = RFM23BP:RFM23BP: HopeRF RFM23BP Library by: http://projects.weber-itam.de; SPICEPREFIX: U
U2 = SparkFun-Sensors:LSM9DS1: LSM9DS1 3D accelerometer, gyroscope & magnetometer The LSM9DS1 is a system-in-package featuring a 3D digital linear acceleration sensor, a 3D digital angular rate sensor, and a 3D digital magnetic sensor. The LSM9DS1 has a linear acceleration full scale of ±2g/±4g/±8/±16 g, a magnetic field full scale of ±4/±8/±12/±16 gauss and an angular rate of ±245/±500/±2000 dps. The LSM9DS1 includes an I2 C serial bus interface supporting standard and fast mode (100 kHz and 400 kHz) and an SPI serial standard interface. Magnetic, accelerometer and gyroscope sensing can be enabled or set in power-down mode separately for smart power management. The LSM9DS1 is available in a plastic land grid array package (LGA) and it is guaranteed to operate over an extended temperature range from -40 °C to +85 °C.; PROD_ID: IC-12536
U3 = maholli:MAX708RESA-T; MANUFACTURER_PART_NUMBER: MAX708RESAT; VENDOR: ON Semiconductor
U4 = samd21-temp:ATSAMD21G: Atmel SAMD21G SMART ARM-Based Microcontroller The Atmel ® | SMART ™ SAM D21 is a series of low-power microcontrollers using the 32-bit ARM ® Cortex ® -M0+ processor, and ranging from 32- to 64-pins with up to 256KB Flash and 32KB of SRAM. The SAM D21 devices operate at a maximum frequency of 48MHz and reach 2.46 CoreMark/MHz. They are designed for simple and intuitive migration with identical peripheral modules, hex compatible code, identical linear address map and pin compatible migration paths between all devices in the product series. All devices include intelligent and flexible peripherals, Atmel Event System for inter-peripheral signaling, and support for capacitive touch button, slider and wheel user interfaces.; PROD_ID: IC-13064
U5 U6 = maholli:MAX4372TEUK+T; MANUFACTURER_PART_NUMBER: MAX4372TEUK+T; VENDOR: Maxim Integrated Products
U7 = maholli:TPS54226PWPR; MANUFACTURER_PART_NUMBER: TPS54226PWPR; VENDOR: Texas Instruments
U8 = BrownSpaceEngineering:LTC4121-4.2
U9 = BrownSpaceEngineering:LC05111C13MTTTG
U10 = maholli:EP2W+
U11 = maholli:S1216V8
X1-X3 = con-coax:BU-SMA-V: FEMALE SMA CONNECTOR Radiall distributor RS 112-3794; OC_FARNELL: unknown; OC_NEWARK: unknown
Y1 = samd21-temp:CRYSTAL: Various standard crystals. Proven footprints.; PROD_ID: XTAL-13062

## Net classes
0 default: width 0.272 mm, drill 0.381 mm, clearance 0.254 mm

## Board
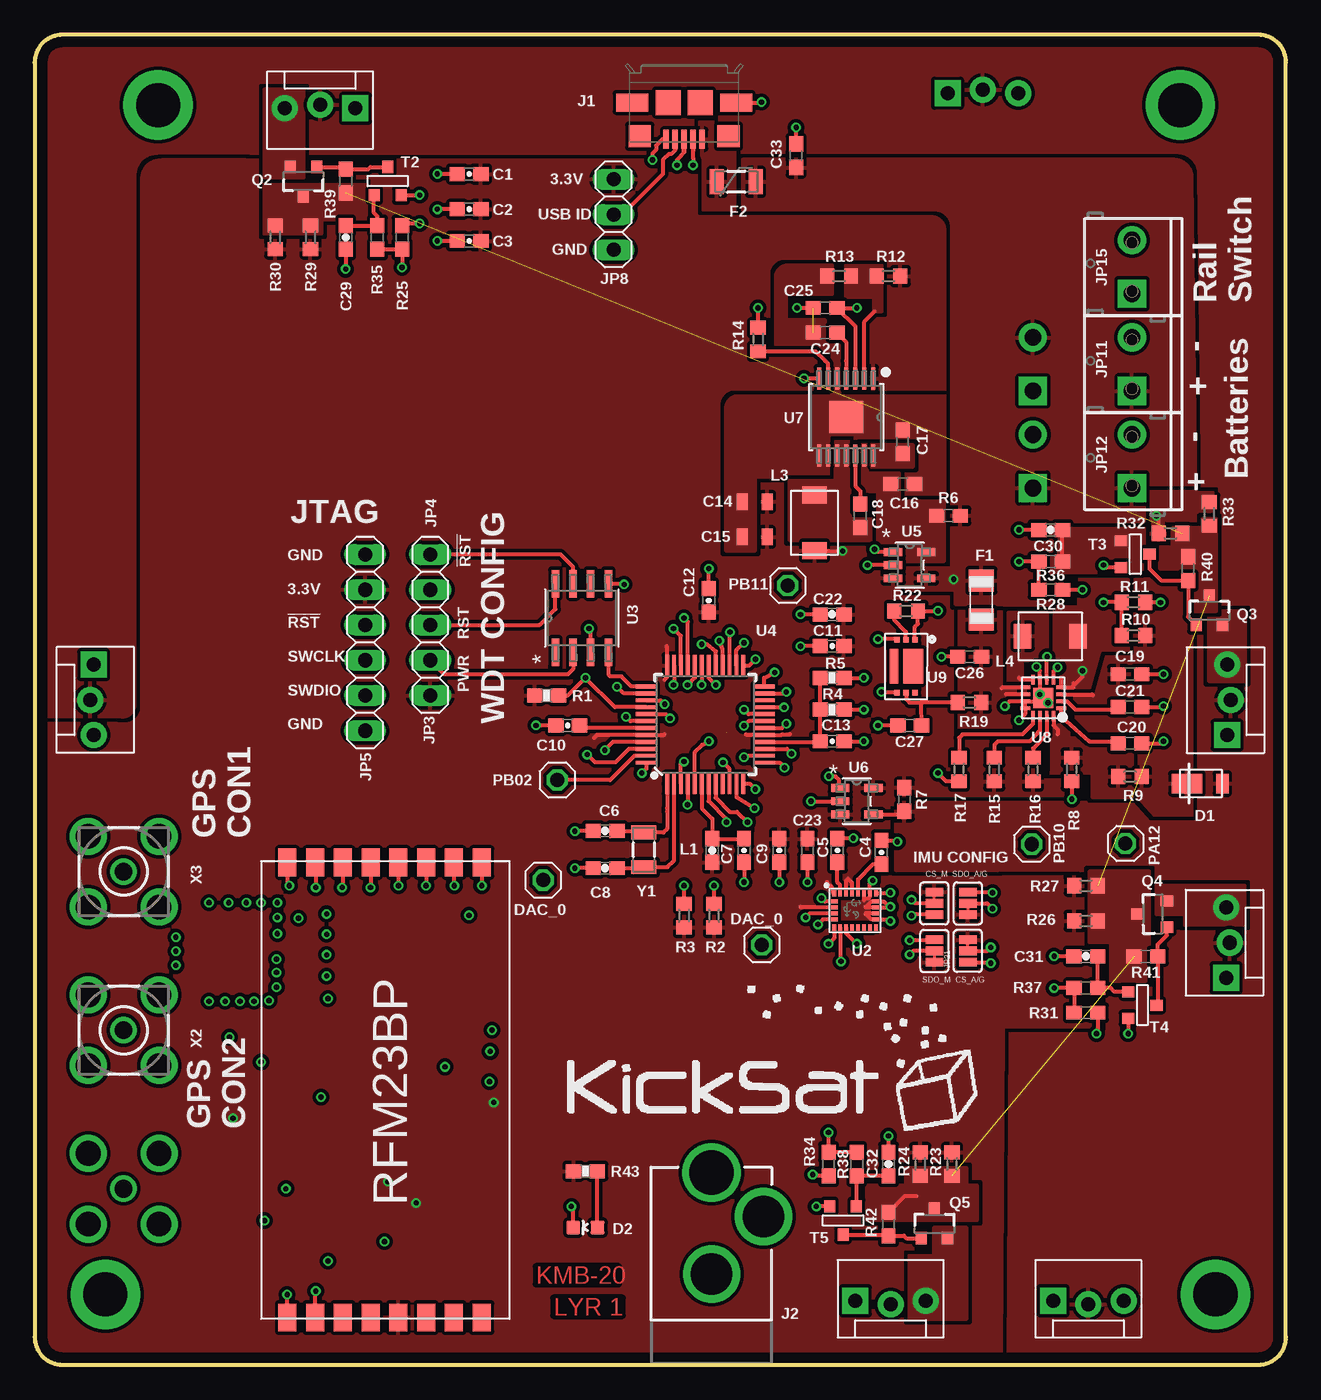
[diagram p4: board, top side]
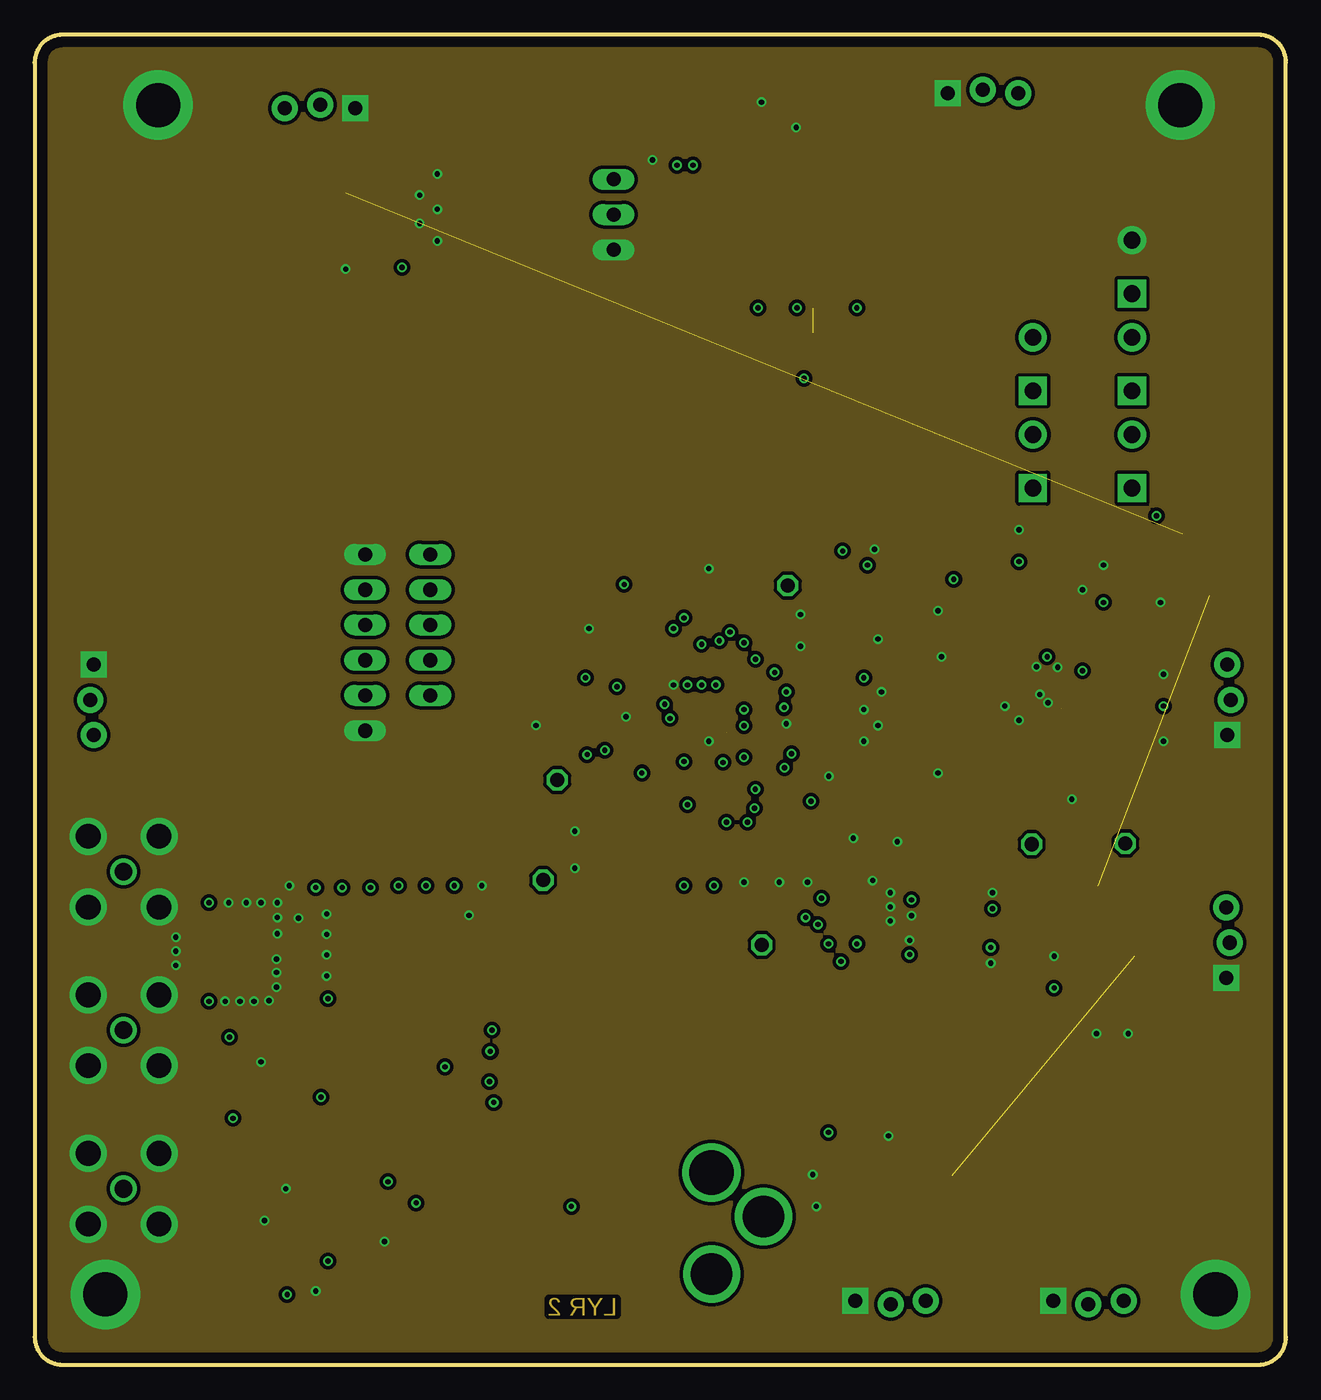
[diagram p5: board, inner layer Route2]
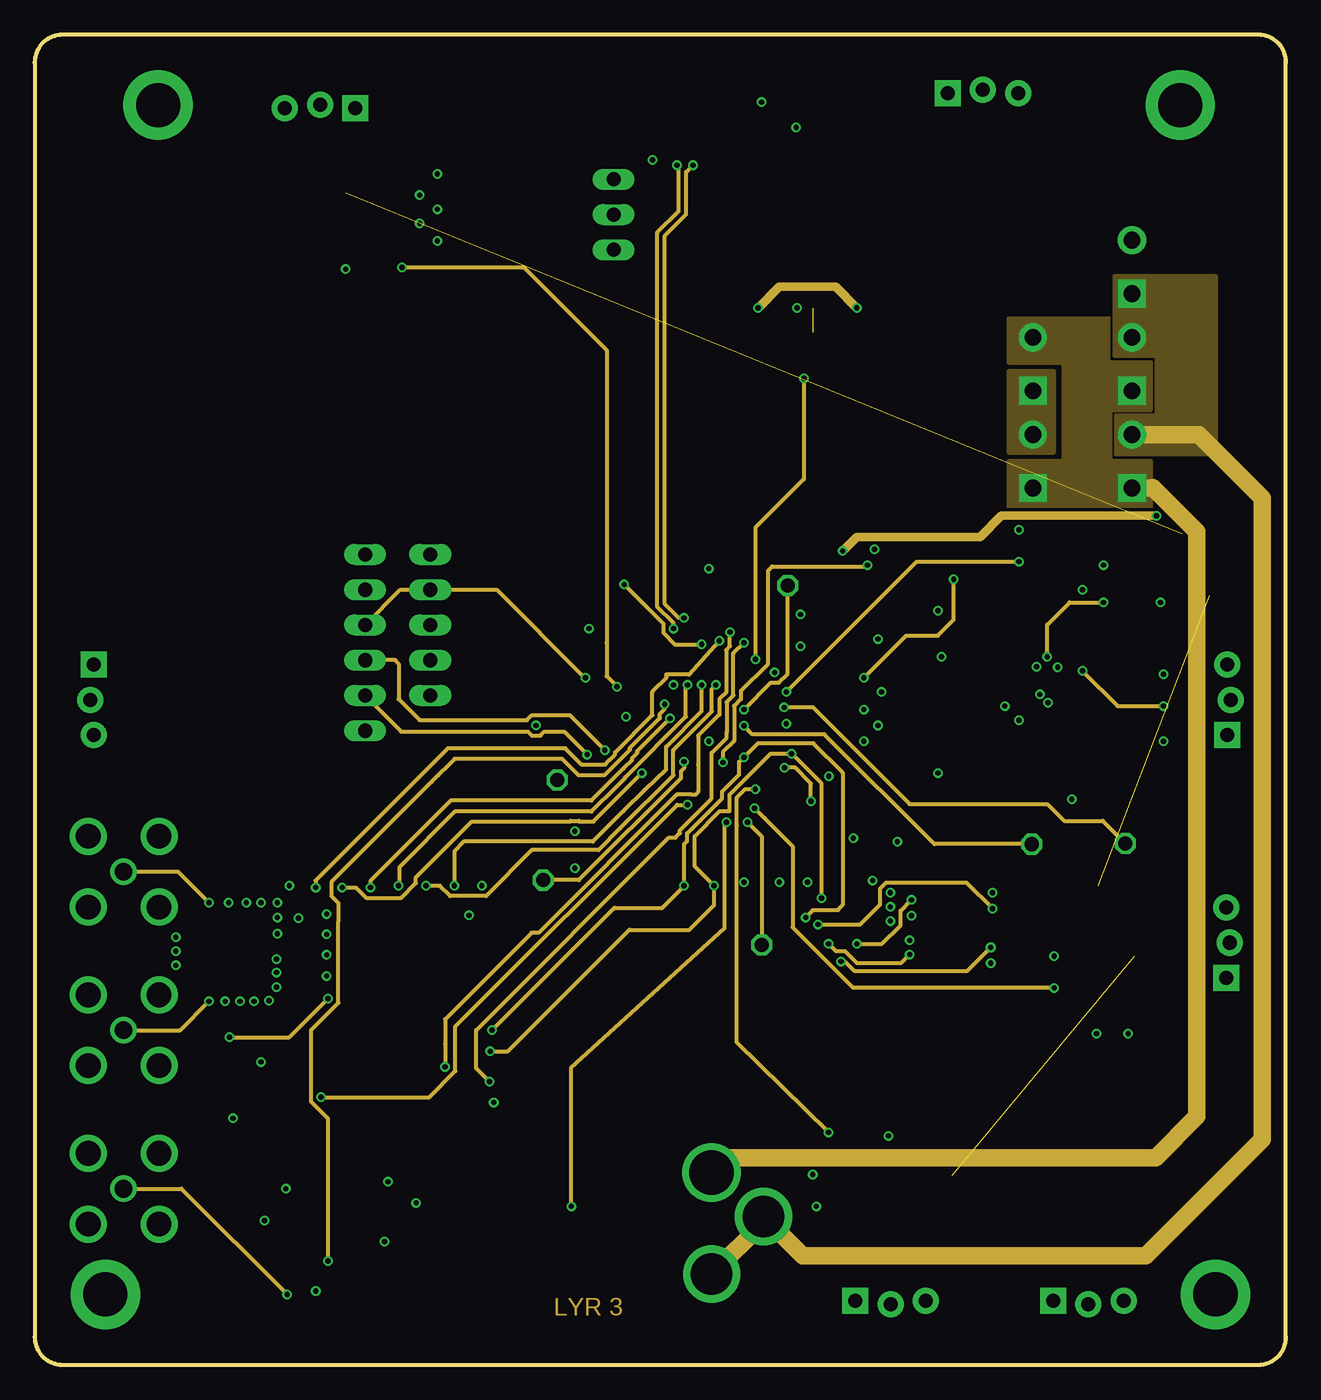
[diagram p6: board, inner layer Route15]
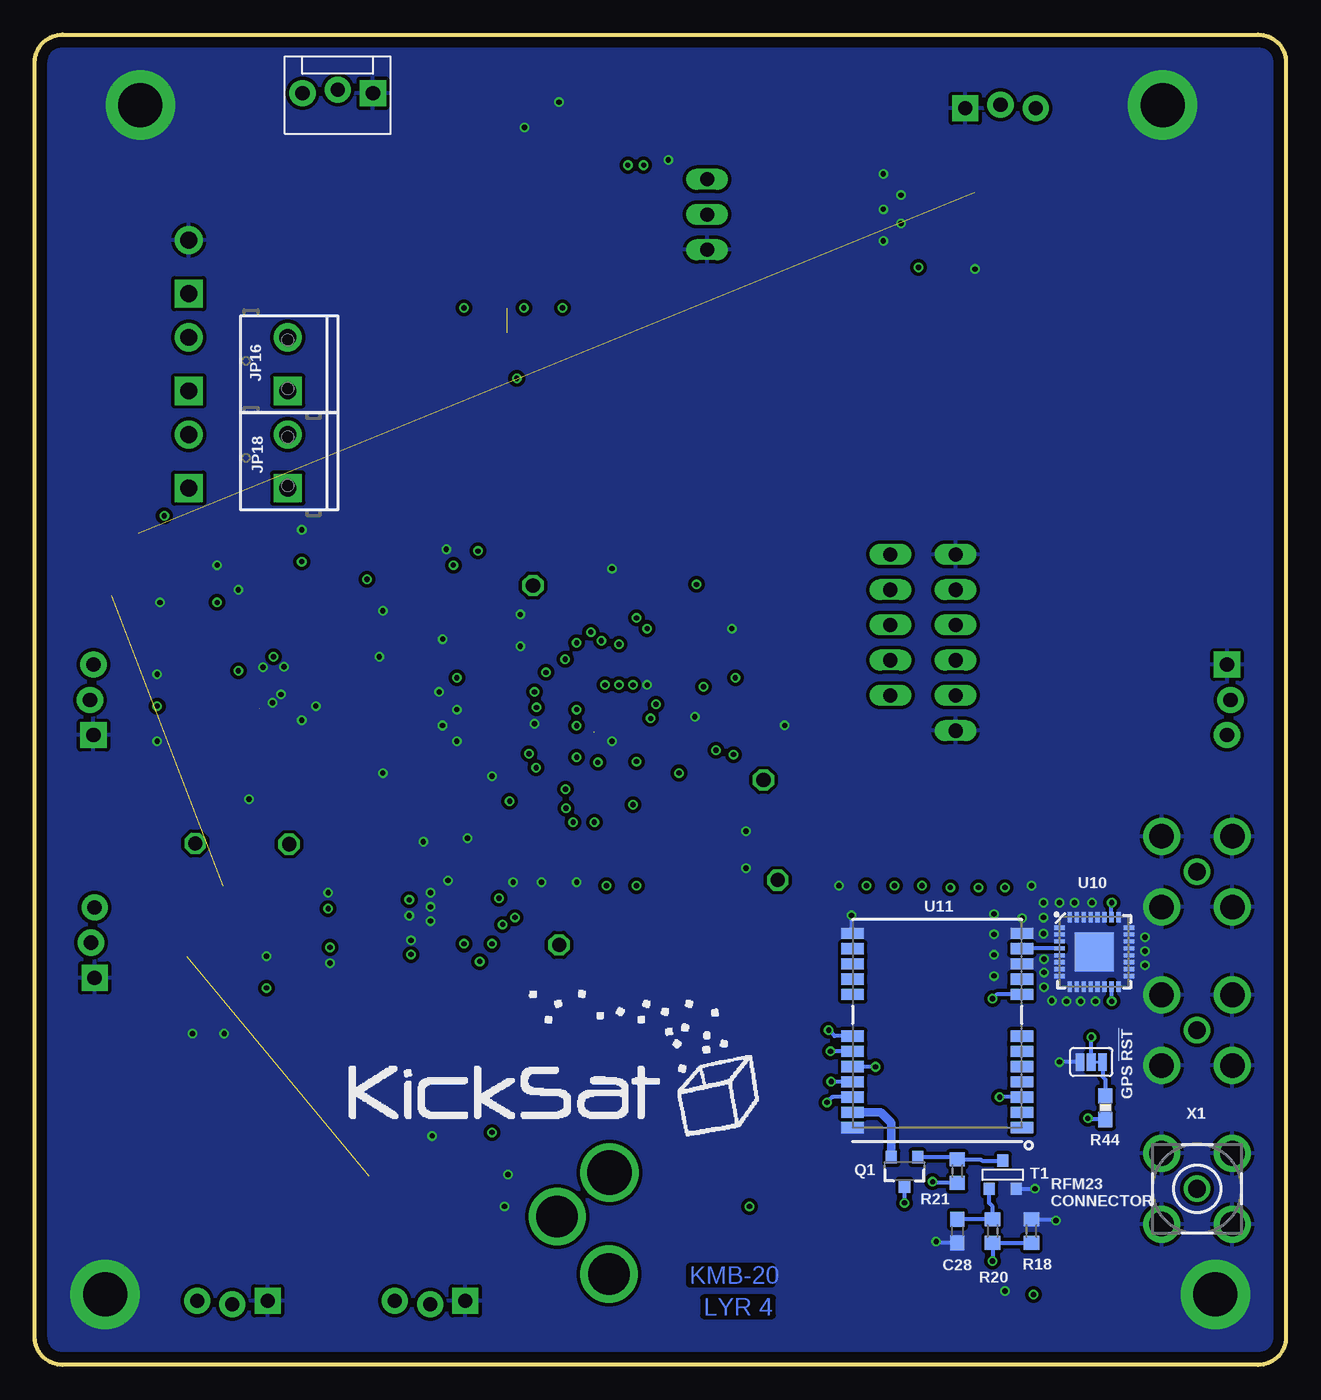
[diagram p7: board, bottom side, seen from below]

Size 90.17 x 95.89 mm. Coordinates in mm from the lower left corner, seen from the top.
Outline: 0,93.89 0,2 arc90 2,0 88.17,0 arc90 90.17,2 90.17,93.89 arc90 88.17,95.89 2,95.89 arc90 0,93.89
Copper layers (1*2*15*16): Top 0.035559375mm / dielectric 0.17018125mm / Route2 0.01778125mm / dielectric 47mil / Route15 0.01778125mm / dielectric 0.17018125mm / Bottom 0.035559375mm
Design rules "oshpark-4layer *": minimum track width 11mil, minimum drill 15mil, track to track 8mil, track to pad 8mil, pad to pad 8mil, via to via 8mil, smd to smd 8mil, copper to edge 30mil, drill to drill 10mil, minimum pad ring 6mil, minimum via ring 6mil, stop-mask expansion 2.5mil, vias tented up to drill 0mil, thermal gap 10mil

### Footprints (pad centres in the part's own frame; a part is rotated, then mirrored left to right if it is on the bottom)
0603-CAP = smd 1.1 x 1: 1 -0.85,0; 2 0.85,0
0603-CAP@1 = smd 1.1 x 1: 1 -0.85,0; 2 0.85,0
0805 = smd 0.8 x 1.2: 1 -0.9,0; 2 0.9,0
0603 = smd 1.1 x 1: 1 -0.85,0; 2 0.85,0
PWRDI-123 = smd 0.9 x 1.4: A 1.45,0 | smd 2.2 x 1.4: C -1.1,0
LED-0603 = smd 1 x 1: A 0,-0.877; C 0,0.877
1206 = smd 1.6 x 1.8: 1 -1.4,0; 2 1.4,0
PTC-1206 = smd 1 x 1.8: 1 -1.4,0; 2 1.4,0
1981584-1 = smd 0.4 x 1.35: 1 -1.3,4.1; 2 -0.65,4.1; 3 0,4.1; 4 0.65,4.1; 5 1.3,4.1 | smd 1.8 x 1.8: M1 -1.15,1.45; M2 1.15,1.45 | smd 2.3 x 1.3: S1 -3.75,1.45; S2 3.75,1.45 | smd 1.6 x 1.6: S3 -3.2,3.885; S4 3.2,3.885
POWER_JACK_PTH_LOCK = drill 2.997 pad 4.115: GND 0.025,6.557; GNDBREAK 3.762,10.7 | drill 3.2 pad 4.115: PWR 0,13.878
PAD-JUMPER-3-2OF3_NC_BY_TRACE_YES_SILK_FULL_BOX = smd 0.635 x 1.27: 1 -0.813,0; 2 0,0; 3 0.813,0
1X02 = drill 1.016 long: 1 -1.27,0; 2 1.27,0
1X03 = drill 1.016 long: 1 -2.54,0; 2 0,0; 3 2.54,0
1X06 = drill 1.016 long: 1 -6.35,0; 2 -3.81,0; 3 -1.27,0; 4 1.27,0; 5 3.81,0; 6 6.35,0
MOLEX-1X3_LOCK = drill 1.016 pad 1.88 square: 1 0,0.127 | drill 1.016 pad 1.88: 2 2.54,-0.127; 3 5.08,0.127
SCREWTERMINAL-3.5MM-2_LOCK = drill 1.2 pad 2.032 square: 1 -0.178,0 | drill 1.2 pad 2.032: 2 3.678,0
1X01 = drill 1.016 octagon: 1 0,0
1812 = smd 1.25 x 1.75: P$1 -2,0; P$2 2,0
SOT23-3 = smd 0.8 x 0.9: 1 -0.95,-1; 2 0.95,-1; 3 0,1.1
0603-RES = smd 1.1 x 1: 1 -0.85,0; 2 0.85,0
R0603 = smd 1 x 1.1: 1 -0.85,0; 2 0.85,0
SOT-23 = smd 0.787 x 0.889: 1 0.025,-1.016; 2 -0.94,1.016; 3 0.991,1.016
RFM23BP = smd 2 x 1.3: ANT 16.9,-7.5; GND1 -15.9,6.5; GND2 -15.9,-7.5; GND3 16.9,-5.5; GPIO_0 16.9,2.5; GPIO_1 16.9,4.5; GPIO_2 16.9,6.5; NIRQ -15.9,-3.5; NSEL -15.9,-1.5; RXON 16.9,-1.5; SCK -15.9,0.5; SDI -15.9,2.5; SDN -15.9,-5.5; SDO -15.9,4.5; TXON 16.9,-3.5; VCC 16.9,0.5
LGA24-8X4 = smd 0.27 x 0.45: 1 -1.505,1.225; 6 -1.505,-1.225; 7 -1.075,-1.225; 8 -0.645,-1.225; 9 -0.215,-1.225; 10 0.215,-1.225; 11 0.645,-1.225; 12 1.075,-1.225; 13 1.505,-1.225; 18 1.505,1.225; 19 1.075,1.225; 20 0.645,1.225; 21 0.215,1.225; 22 -0.215,1.225; 23 -0.645,1.225; 24 -1.075,1.225 | smd 0.45 x 0.27: 2 -1.475,0.645; 3 -1.475,0.215; 4 -1.475,-0.215; 5 -1.475,-0.645; 14 1.475,-0.645; 15 1.475,-0.215; 16 1.475,0.215; 17 1.475,0.645
SO8 = smd 1.981 x 0.533: 1 -2.464,1.905; 2 -2.464,0.635; 3 -2.464,-0.635; 4 -2.464,-1.905; 5 2.464,-1.905; 6 2.464,-0.635; 7 2.464,0.635; 8 2.464,1.905
TQFP-48 = smd 1.5 x 0.28: 1 -4.25,2.75; 2 -4.25,2.25; 3 -4.25,1.75; 4 -4.25,1.25; 5 -4.25,0.75; 6 -4.25,0.25; 7 -4.25,-0.25; 8 -4.25,-0.75; 9 -4.25,-1.25; 10 -4.25,-1.75; 11 -4.25,-2.25; 12 -4.25,-2.75; 25 4.25,-2.75; 26 4.25,-2.25; 27 4.25,-1.75; 28 4.25,-1.25; 29 4.25,-0.75; 30 4.25,-0.25; 31 4.25,0.25; 32 4.25,0.75; 33 4.25,1.25; 34 4.25,1.75; 35 4.25,2.25; 36 4.25,2.75 | smd 0.28 x 1.5: 13 -2.75,-4.25; 14 -2.25,-4.25; 15 -1.75,-4.25; 16 -1.25,-4.25; 17 -0.75,-4.25; 18 -0.25,-4.25; 19 0.25,-4.25; 20 0.75,-4.25; 21 1.25,-4.25; 22 1.75,-4.25; 23 2.25,-4.25; 24 2.75,-4.25; 37 2.75,4.25; 38 2.25,4.25; 39 1.75,4.25; 40 1.25,4.25; 41 0.75,4.25; 42 0.25,4.25; 43 -0.25,4.25; 44 -0.75,4.25; 45 -1.25,4.25; 46 -1.75,4.25; 47 -2.25,4.25; 48 -2.75,4.25
21-0057F = smd 1.321 x 0.559: 1 -1.194,0.95; 2 -1.194,0; 3 -1.194,-0.95; 4 1.194,-0.95; 5 1.194,0.95
PWP14_2P31X2P46-L = smd 1.6 x 0.305: 1 -2.769,1.95; 2 -2.769,1.3; 3 -2.769,0.65; 4 -2.769,0; 5 -2.769,-0.65; 6 -2.769,-1.3; 7 -2.769,-1.95; 8 2.769,-1.95; 9 2.769,-1.3; 10 2.769,-0.65; 11 2.769,0; 12 2.769,0.65; 13 2.769,1.3; 14 2.769,1.95 | smd 2.31 x 2.46: 15 0,0
QFN-16-PAD = smd 0.7 x 0.25: P$1 -1.3,0.75; P$2 -1.3,0.25; P$3 -1.3,-0.25; P$4 -1.3,-0.75; P$9 1.3,-0.75; P$10 1.3,-0.25; P$11 1.3,0.25; P$12 1.3,0.75 | smd 0.25 x 0.7: P$5 -0.75,-1.3; P$6 -0.25,-1.3; P$7 0.25,-1.3; P$8 0.75,-1.3; P$13 0.75,1.3; P$14 0.25,1.3; P$15 -0.25,1.3; P$16 -0.75,1.3 | smd 1.45 x 1.45: P$17 0,0
WDFN6 = smd 0.4 x 0.4: P$1 -0.66,-1.89; P$2 -0.01,-1.89; P$3 0.64,-1.89; P$4 0.64,1.91; P$5 -0.01,1.91; P$6 -0.66,1.91 | smd 1.42 x 2.5: PAD1 -0.54,0 | smd 0.62 x 2.5: PAD2 0.85,0
QFN32-5X5MM = smd 0.762 x 0.305: 1 -2.5,1.75; 2 -2.5,1.25; 3 -2.5,0.75; 4 -2.5,0.25; 5 -2.5,-0.25; 6 -2.5,-0.75; 7 -2.5,-1.25; 8 -2.5,-1.75; 17 2.5,-1.75; 18 2.5,-1.25; 19 2.5,-0.75; 20 2.5,-0.25; 21 2.5,0.25; 22 2.5,0.75; 23 2.5,1.25; 24 2.5,1.75 | smd 0.305 x 0.762: 9 -1.75,-2.5; 10 -1.25,-2.5; 11 -0.75,-2.5; 12 -0.25,-2.5; 13 0.25,-2.5; 14 0.75,-2.5; 15 1.25,-2.5; 16 1.75,-2.5; 25 1.75,2.5; 26 1.25,2.5; 27 0.75,2.5; 28 0.25,2.5; 29 -0.25,2.5; 30 -0.75,2.5; 31 -1.25,2.5; 32 -1.75,2.5 | smd 2.794 x 2.794: EP 0,0
S1216_24PIN_PACKAGE = smd 1.626 x 0.813: 1 5.85,-7.62; 2 5.85,-6.52; 3 5.85,-5.42; 4 5.85,-4.32; 5 5.85,-3.22; 6 5.85,-2.12; 7 5.85,-1.02; 8 5.85,1.98; 9 5.85,3.08; 10 5.85,4.18; 11 5.85,5.28; 12 5.85,6.38; 13 -6.35,6.38; 14 -6.35,5.28; 15 -6.35,4.18; 16 -6.35,3.08; 17 -6.35,1.98; 18 -6.35,-1.02; 19 -6.35,-2.12; 20 -6.35,-3.22; 21 -6.35,-4.32; 22 -6.35,-5.42; 23 -6.35,-6.52; 24 -6.35,-7.62
BU-SMA-V = drill 1.27: 1 0,0 | drill 1.778: 2 -2.55,2.55; 3 2.55,2.55; 4 2.55,-2.55; 5 -2.55,-2.55
CRYSTAL-SMD-3.2X1.5MM = smd 1 x 1.8: P$1 -1.25,0; P$2 1.25,0

### Placement (x,y rotation side)
C1  31.3,85.84 180 top
C2  31.3,83.3 180 top
C3  31.3,81.02 180 top
C4  61.02,36.95 90 top
C5  57.84,37.07 90 top
C6  41.11,38.5 0 top
C7  51.11,37.07 270 top
C8  41.11,35.8 180 top
C9  53.65,37.07 270 top
C10  38.41,46.09 180 top
C11  57.46,51.81 180 top
C12  48.57,55.11 90 top
C13  57.46,44.95 0 top
C14  51.88,62.22 0 top
C15  51.88,59.68 0 top
C16  62.54,63.49 0 top
C17  62.54,66.54 90 top
C18  59.5,61.2 90 top
C19  78.93,49.78 0 top
C20  78.93,44.8 0 top
C21  78.93,47.42 0 top
C22  57.46,54.09 180 top
C23  55.69,37.07 270 top
C24  56.96,74.41 180 top
C25  56.96,76.19 180 top
C26  67.37,51.04 180 top
C27  63.06,46.09 180 top
C28  23.68,9.64 270 bottom
C29  22.41,81.27 270 top
C30  73.21,60.19 180 top
C31  75.75,29.45 180 top
C32  61.53,14.47 90 top
C33  54.87,87.16 90 top
D1  84.13,41.9 0 top
D2  39.68,9.9 90 top
F1  68.21,55.13 90 top
F2  50.56,85.28 0 top
FRAME1  -7.36,48 0 top  (outside the outline)
FRAME2  -7.05,39.11 0 top  (outside the outline)
FRAME3  -7.36,21.33 0 top  (outside the outline)
FRAME4  -7.36,30.22 0 top  (outside the outline)
J1  46.8,92.45 180 top
J2  48.76,-0.01 0 top
JP1  67.24,33.26 270 top
JP2  64.83,29.84 270 top
JP3  28.51,49.52 270 top
JP4  28.51,55.87 270 top
JP5  23.81,52.06 270 top
JP6  23.11,90.71 180 top
JP7  86.06,45.39 90 top
JP8  41.72,82.92 270 top
JP9  59.14,4.49 0 top
JP10  85.98,27.89 90 top
JP11  79.07,70.38 90 top
JP12  79.07,63.38 90 top
JP13  65.79,91.79 180 bottom
JP14  73.38,4.49 0 top
JP15  79.07,77.39 90 top
JP16  71.93,70.38 90 bottom
JP17  4.12,50.47 270 top
JP18  71.93,63.38 90 bottom
JP19  14.03,21.83 0 bottom
JP20  64.83,33.26 90 top
JP21  67.24,29.84 90 top
JP22  36.64,34.94 0 top
JP24  78.6,37.58 0 top
JP25  54.26,56.17 0 top
JP26  71.84,37.53 0 top
JP27  52.38,30.27 0 top
JP28  37.65,42.15 0 top
L1  48.83,37.07 90 top
L2  37.91,16.63 0 top
L3  56.19,60.7 90 top
L4  73.19,52.52 180 top
L5  KICKSAT_LOGO  [KICKSAT_LOGO]  68,16.25 0 bottom
Q1  27.49,13.96 180 bottom
Q2  19.36,85.33 180 top
Q3  84.64,54.35 0 top
Q4  80.58,32.5 90 top
Q5  64.83,10.15 0 top
R1  36.89,48.25 180 top
R2  48.96,32.38 270 top
R3  46.8,32.38 270 top
R4  57.46,47.23 180 top
R5  57.46,49.52 0 top
R6  65.85,61.2 0 top
R7  62.67,40.76 270 top
R8  74.74,42.92 270 top
R9  78.93,42.41 0 top
R10  79.18,52.57 0 top
R11  79.18,54.97 180 top
R12  61.53,78.48 0 top
R13  57.97,78.48 0 top
R14  52.13,73.9 90 top
R15  69.15,42.92 270 top
R16  71.94,42.92 270 top
R17  66.61,42.92 90 top
R18  18.35,9.64 90 bottom
R19  67.37,47.74 0 top
R20  21.14,9.64 270 bottom
R21  23.68,13.96 90 bottom
R22  62.8,54.35 180 top
R23  66.1,14.47 90 top
R24  63.81,14.47 90 top
R25  26.48,81.27 270 top
R26  75.75,31.99 180 top
R27  75.75,34.53 180 top
R28  73.21,55.87 180 top
R29  19.87,81.27 270 top
R30  17.33,81.27 270 top
R31  75.75,25.39 180 top
R32  81.85,59.93 180 top
R33  84.64,61.33 90 top
R34  57.21,14.47 90 top
R35  24.7,81.27 90 top
R36  73.21,57.9 0 top
R37  75.75,27.17 0 top
R38  59.24,14.47 270 top
R39  22.41,85.33 270 top
R40  83.12,57.39 90 top
R41  80.07,29.45 180 top
R42  61.53,10.15 90 top
R43  39.68,13.96 180 top
R44  13.01,18.53 270 bottom
T1  20.38,13.71 180 bottom
T2  25.46,85.33 180 top
T3  79.31,58.41 90 top
T4  79.82,25.9 90 top
T5  58.23,10.4 0 top
U1  25.71,20.31 270 top
U2  59.12,32.76 0 top
U3  39.43,53.84 90 top
U4  48.32,46.15 90 top
U5  63.05,57.65 0 top
U6  59.24,40.63 0 top
U7  58.48,68.32 270 top
U8  72.68,48.08 180 top
U9  62.77,50.36 180 top
U10  13.83,29.77 0 bottom
U11  24.88,24.72 0 bottom
X1  6.41,12.69 0 bottom
X2  6.41,24.12 270 top
X3  6.41,35.55 270 top
Y1  43.9,37.12 90 top

### Tracks (layer width: path | path; a pad name or v marks a point on that pad's centre or on a via)
3.3V  (via drill 0.38)
  Top 0.279: C9.1 53.6,38.09 | L1.1 48.99,36.21 | 62.6,41.54 R7.1 | 45.53,51.81 45.57,51.76 U4.36 45.57,49.56 45.4,49.39 | U2.1 57.59,34 57.46,34.41 57.08,34.79 | U2.23 58.47,34.91 58.61,35.04 58.9,34.75 U2.22 | 45.4,45.46 45.35,45.4 U4.44 40.52,45.4 40.32,45.2 | 51.24,45.46 51.29,45.4 U4.17 53.83,45.4 53.88,45.46 54.42,45.46 | U2.3 55.22,32.97 55.18,33.01 | R32.2 81,61.04 v80.83,61.2 | L3.P$1 56.23,58.66 v58.23,58.66
  Route15 0.61: v58.23,58.66 59.24,59.68 68.13,59.68 69.66,61.2 v80.83,61.2
  Bottom 0.279: R21.1 25.37,13.11 v25.46,13.2 | Q1.3 v27.49,11.67 | R44.2 14.2,17.68 v14.28,17.77 | U11.22 32.69,19.3 v33.08,18.91
  pour Top (isolate 0.254, rank 6): 88.17,0 2,0 arc-90 0,2 0,93.89 arc-90 2,95.89 88.17,95.89 arc-90 90.17,93.89 90.17,2 arc-90
  pour Top: 69.78,35.17 75.5,35.17 75.5,24.37 69.78,24.37
  pour Top (no thermals): 80.58,59.55 81.34,59.55 81.34,60.95 83.5,60.95 83.5,61.59 84.9,61.59 84.9,62.86 80.58,62.86
!RESET  (via drill 0.38)
  Top 0.279: U4.40 41.8,47.4 v39.68,49.52 38.41,48.25 R1.1
  Route15 0.272: v39.68,49.52 39.51,49.64 33.28,55.87 30.41,55.87 28.76,55.87 | 28.76,55.87 JP4.2 | JP5.3 26.35,55.87 28.76,55.87
DAC_0  (via drill 0.38)
  Top 0.279: U4.3 46.57,43.33 v46.8,43.49
  Route15 0.272: v46.8,43.49 46.8,43.02 46.56,42.78 46.56,42.71 46.56,42.28 39.22,34.94 JP22.1
ENAB_BURN1  (via drill 0.38)
  Top 0.279: R35.1 R25.2 v26.48,79.11 | U4.38 42.45,48.4 v41.97,48.89
  Route15 0.272: v41.97,48.89 41.21,49.65 41.21,52.06 41.21,73.14 35.24,79.11 v26.48,79.11
ENAB_BURN2  (via drill 0.38)
  Top 0.279: R28.2 R36.1 v70.93,57.9 | U4.23 54.06,48.4 v54.16,48.5
  Route15 0.272: v54.16,48.5 63.56,57.9 v70.93,57.9
ENAB_BURN3  (via drill 0.38)
  Top 0.279: R31.2 R37.1 v73.47,27.17 | U4.11 50.57,40.92 v51.88,40.12
  Route15 0.272: 54.62,31.54 58.96,27.19 73.44,27.19 v73.47,27.17 | v51.88,40.12 52.61,39.39
  Route15 0.279: 52.61,39.39 54.62,37.38 54.62,31.54
ENAB_BURN4  (via drill 0.38)
  Top 0.279: U4.12 51.52,41.9 v51.93,41.49 | R38.1 R34.2 v57.21,16.75
  Route15 0.272: v57.21,16.75 50.61,23.23 50.61,38.85 50.61,40.88 51.22,41.49 v51.93,41.49
ENAB_GPS  (via drill 0.38)
  Top 0.279: U4.39 45.11,47.9 v45.4,47.62
  Route15 0.272: v21.14,7.48 21.14,17.74 19.9,18.99 19.9,24.12 21.88,26.1 21.88,31.97 21.9,31.99 21.9,33.26 21.4,33.77 21.42,33.8 21.42,34.84 28.62,42.04 | v45.4,47.62 45.4,47.26 45.04,46.9 45.04,46.62 42.89,44.46 42.89,44.33 41.07,42.51 39.18,42.51 38.01,43.68 30.26,43.68 28.62,42.04 | 28.62,42.04 29.1,42.51
  Bottom 0.279: R18.1 R20.2 v21.14,7.48
GND  (via drill 0.38, 3.17 pad 5)
  Top 0.279: J1.S1 52.36,91 v52.38,91.02 | C33.2 v54.87,89.2 | R8.2 v74.74,40.78 | R11.1 81.11,54.98 v81.14,54.96 | v72.2,50.32 72.43,50.05 U8.P$7 v72.43,48.33 U8.P$17 73.03,47.73 v73.03,47.72 | U8.P$5 73.43,49.99 v73.72,50.28 | C20.2 81.19,44.8 v81.34,44.95 | C19.2 81.33,49.78 v81.34,49.77 | v69.91,47.49 70.25,47.83 U8.P$11 72.16,47.83 72.2,47.87 | v70.93,46.47 71.38,46.93 U8.P$12 71.38,47.79 | C26.2 v65.34,51.04 | U9.P$4 61.07,48.45 v61.02,48.5 | U9.P$1 63.43,53.2 63.65,53.42 R22.1 v65.08,54.35 | U9.P$3 62.07,52.31 v60.77,52.31 | C27.2 v60.77,46.09 | C12.2 v48.57,57.39 | C7.2 v51.11,34.79 | C9.2 v53.65,34.79 | C23.2 v55.69,34.79 | C11.2 v55.18,51.81 | C22.2 v55.18,54.09 | T2.2 v27.75,84.32 | R25.1 26.64,82.29 v27.75,82.29 | C29.2 v22.41,78.98 | 73.97,55.78 R28.1 v75.5,55.87 | C30.2 v70.93,60.19 | R31.1 76.6,23.95 v76.51,23.87 | T4.2 v78.8,23.87 | C31.2 v73.47,29.45 | U3.3 40.07,52.95 v39.94,53.08 | C3.2 v29.02,81.02 | C2.2 v29.02,83.3 | C1.2 v29.02,85.84 | JP1.1 68.97,34.08 v69.02,34.03 | JP2.1 64.78,30.6 v63.05,30.6 | J1.5 45.24,88.35 44.79,87.9 44.79,87.6 44.51,87.32 v44.51,86.86 | U2.18 60.66,34.03 v61.66,34.03 | 61.62,32.97 U2.16 59.92,32.97 59.88,33.01 60.27,33.4 U2.17 61.19,33.4 61.62,32.97 | 61.62,32.97 v61.66,33.01 | v61.66,31.99 61.54,32.11 U2.14 60.27,32.11 59.88,32.5 59.92,32.54 U2.15 | U4.5 47.57,44.17 48.09,44.69 v48.57,44.95 | R17.1 65.68,42.07 v65.08,42.66 | T3.2 77.2,57.47 v77.02,57.65 | U1.GND3 20.21,5.29 v20.25,5.32 | U4.35 46.07,48.85 v46.03,49.01 | U1.GND1 v32.21,34.54 v32.22,34.53 | U1.GND2 18.21,34.67 v18.35,34.53 | U4.42 42.93,46.4 v42.61,46.73 | C10.2 v36.13,46.09 | C32.2 v61.53,16.5 | R34.1 56.16,13.62 v56.07,13.71
  Top 0.279: T5.2 v56.32,11.42 | C13.2 v59.75,44.95 | R4.1 v59.75,47.23 | U5.1 60.69,58.6 v60.51,58.78 | U6.1 58.05,41.6 57.97,41.67 57.97,42.15 57.71,42.42 v57.22,42.42 | v60.39,34.92 60.19,34.72 U2.19 60.19,33.74 60.04,33.59 59.86,33.59 59.77,33.51 59.76,33.52 U2.20 | C4.2 62.08,37.8 v62.16,37.71 | C5.2 57.88,37.96 v58.99,37.96 | JP20.1 63.26,32.45 v63.18,32.38 | JP21.1 68.82,29.02 v68.89,28.95 | C6.1 38.95,38.5 v38.92,38.47 | C8.2 v38.92,35.8 | U4.18 53.85,45.9 v54.16,46.22
  Bottom 0.279: U11.13 31.3,31.17 v31.3,32.4 | R18.2 16.66,10.49 v16.57,10.4 | T1.2 v18.09,12.69 | JP19.1 v16.32,21.83 | C28.2 25.12,8.79 v25.21,8.88
  other vias: 8.89,90.81 82.55,90.81 85.09,5.08 5.09,5.08 17.48,32.25 17.43,28.29 13.98,33.31 15.25,33.31 16.32,33.31 17.48,33.31 10.17,30.83 10.17,29.81 10.17,28.79 19.01,32.2 17.48,31.08 17.43,29.25 17.43,27.22 16.87,26.25 15.81,26.2 14.79,26.2 13.73,26.2 21.04,28.03 21.04,29.56 21.04,31.03 21.04,32.5
  pour Bottom: 2,95.89 88.17,95.89 arc-90 90.17,93.89 90.17,2 arc-90 88.17,0 2,0 arc-90 0,2 0,93.89 arc-90
  pour Route2 (no thermals): 2,95.89 88.17,95.89 arc-90 90.17,93.89 90.17,2 arc-90 88.17,0 2,0 arc-90 0,2 0,93.89 arc-90
  pour Top (no thermals): 58.1,33.52 58.1,31.99 60.13,31.99 60.13,33.52
  pour Bottom (no thermals): 8.95,35.55 34.35,35.55 34.35,3.8 11.49,3.8 11.49,19.04 8.95,19.04
GPS_1PPS  (via drill 0.38)
  Top 0.279: U4.4 47.07,40.4 v47.05,40.38
  Route15 0.272: v20.63,19.29 28.43,19.29 30.31,21.17 30.31,24.4 46.29,40.38 v47.05,40.38
  Bottom 0.279: U11.3 20.63,19.3 v20.63,19.29
GPS_PWR
  Bottom 0.61: U11.23 29.19,18.2 28.44,17.45 Q1.2
I2C_SCL  (via drill 0.38)
  Top 0.279: U2.2 56.95,33.4 v56.7,33.65 | R2.1 v48.96,34.53 | U4.15 54.2,44.4 v54.54,44.06
  Route15 0.272: v32.83,22.6 34.1,22.6 42.86,31.36 47.18,31.36 48.96,33.14 v48.96,34.53 47.55,35.94 47.55,38.09 49.38,39.92 50.07,39.92 50.07,41.11 53.03,44.06 v54.54,44.06 56.7,41.9 v56.7,33.65
  Bottom 0.279: U11.19 v32.82,22.6 v32.83,22.6
I2C_SDA  (via drill 0.38)
  Top 0.279: U2.4 55.85,32.54 v55.56,32.25 | U4.14 51.14,43.9 v51.11,43.81 | 46.92,33.35 R3.1 v46.8,34.53
  Route15 0.272: v32.95,24.12 41.78,32.95 45.21,32.95 v46.8,34.53 46.8,37.53 47.02,37.76 47.02,38.32 49.54,40.83 49.54,41.33 50.77,42.55 50.77,43.46 v51.11,43.81 52.11,44.8 56.12,44.8 58.23,42.69 58.23,33.16 57.87,32.81 57.87,32.76 56.07,32.76 v55.56,32.25
  Bottom 0.279: U11.18 32.54,23.7 v32.95,24.12
I2C_SDOA/G  (via drill 0.38)
  Top 0.279: U2.5 56.82,32.11 v56.45,31.74 | JP1.2 68.64,33.26 v69.02,32.88
  Route15 0.272: v69.02,32.88 67.14,34.76 61.35,34.76 60.92,34.33 60.92,33.19 59.47,31.74 v56.45,31.74
I_BATT  (via drill 0.38)
  Top 0.279: U4.10 50.07,42.94 v49.59,43.42 | U5.2 v60,57.65
  Route15 0.272: v49.59,43.42 49.59,44.17 49.6,44.18 50.4,44.98 50.4,47.51 50.89,48 50.89,48.56 52.85,50.52 52.85,57.25 53.15,57.55 59.9,57.55 v60,57.65
I_SOLAR  (via drill 0.38)
  Top 0.279: v55.94,40.63 55.98,40.59 58.01,40.59 U6.2 | U4.13 53.67,43.4 v54.04,43.04
  Route15 0.272: v55.94,40.63 55.94,41.9 54.8,43.04 v54.04,43.04
L1_CHG
  Top 0.279: U8.P$16 73.43,46.09 | 73.43,46.09 73.47,46.09 | 73.43,46.09 73.72,45.8 73.72,45.46
  pour Top (isolate 0.254): 73.34,46.98 74.48,46.98 74.48,45.2 79.05,45.2 79.05,40.88 76.26,40.88 76.26,42.66 73.21,42.66 73.34,42.79
L1_FAULTN
  Top 0.279: U8.P$15 72.93,45.43 71.94,44.44 R16.1
L1_PROG
  Top 0.279: U8.P$13 71.93,46.21 71.18,45.46 66.86,45.46 66.61,45.2 R17.2
LED_GRN  (via drill 0.38)
  Top 0.279: D2.C 38.81,11.28 v38.67,11.42 | U4.7 48.57,40.63 49.84,39.36 v49.84,39.11
  Route15 0.272: v38.67,11.42 38.67,21.45 49.72,31.49 49.72,38.98 v49.84,39.11
LION1
  Top 0.279: U8.P$9 69.73,48.83 69.66,48.76 | U8.P$10 69.99,48.33
  pour Top (rank 3): 71.94,49.27 69.91,49.27 69.91,55.11 66.61,55.11 66.61,45.96 71.94,45.96
N$1
  Top 0.279: D2.A 40.53,9.92 R43.1
N$2
  Top 0.279: U2.21 59.33,35 60.42,36.1 C4.1
N$3
  pour Top (rank 2, no thermals): 57.72,66.54 58.73,66.54 58.73,60.95 60.51,60.95 60.51,59.43 54.42,59.43 54.42,63.74 57.72,63.74
N$4
  pour Route15 (no thermals): 73.47,71.62 70.16,71.62 70.16,65.78 73.47,65.78
N$5
  Top 0.279: R36.2 C30.1
  pour Top (rank 2, no thermals): 73.21,60.44 73.21,57.14 79.56,57.14 79.56,57.39 81.85,57.39 81.85,58.92 79.94,58.92 79.94,60.44
N$6
  Top 0.279: U2.24 58.04,34.59 57.84,34.79 C5.1
N$7
  Top 0.279: Q2.1 22.26,86.33 R39.1 24.02,86.18 24.19,86.35 T2.1
N$8
  Top 0.279: U3.2 38.8,50.16 38.41,49.77 29.52,49.77 JP3.1
N$9  (via drill 0.38)
  Route15 0.272: v14.03,23.61 18.35,23.61 v21.14,26.41
  Bottom 0.279: U11.8 20.85,26.7 v21.14,26.41 | JP19.2 v14.03,23.61
N$10
  Bottom 0.279: T1.3 21.4,12.67 21.4,11.67 21.14,11.42 R20.1 C28.1
N$11
  Top 0.279: T4.3 77.81,26.89 77.53,27.17 R37.2 C31.1
N$12
  Bottom 0.279: T1.1 21.9,14.72 21.99,14.81 R21.2 23.83,14.96 Q1.1
N$13
  pour Top: 47.91,89.55 47.91,87.47 48.17,87.01 48.17,83.3 50.45,83.3 50.45,87.52 48.93,87.52 48.93,89.55
N$14
  Top 0.279: U7.12 59.13,63.35 59.5,62.98 C18.2
N$15
  Top 0.279: Q3.1 83.12,53.92 R40.1 81.17,56.54 80.32,57.39 T3.1
N$16  (via drill 0.38)
  Route15 0.272: X2.1 10.47,24.12 v12.56,26.2
  Bottom 0.279: U10.15 12.58,26.22 v12.56,26.2
N$17  (via drill 0.38)
  Route15 0.272: X3.1 10.32,35.55 v12.56,33.32
  Bottom 0.279: U10.26 12.58,33.3 v12.56,33.32
N$18
  Top 0.279: L1.2 48.88,38.03 48.89,38.03 | U4.6 48.07,40.12 48.83,39.36 L1.2 | L1.2 C7.1
N$19  (via drill 0.38)
  Top 0.279: U1.ANT 18.21,5.05 v18.2,5.07
  Route15 0.272: X1.1 10.58,12.69 v18.2,5.07
N$21  (via drill 0.38)
  Top 0.279: JP2.2 63.31,29.84 v63.05,29.58 | U2.6 57.61,30.74 v57.21,30.34
  Route15 0.272: v63.05,29.58 62.42,28.95 59.27,28.95 58.4,29.81 57.74,29.81 v57.21,30.34
N$22
  Route15 1.27: JP12.2 83.87,67.06 88.45,62.47 88.45,16.25 80.07,7.86 55.35,7.86 J2.GNDBREAK 52.52,10.28 J2.GND
  pour Route15 (no thermals): 77.91,68.44 77.91,65.65 85.15,65.65 85.15,78.48 77.78,78.48 77.78,75.81 77.78,72.76 80.83,72.76 80.83,68.57 80.83,68.44
N$23  (via drill 0.38)
  Top 0.279: JP20.2 63.43,33.26 v63.18,33.52 | U2.8 58.47,31.12 v59.24,30.34
  Route15 0.272: v63.18,33.52 62.39,32.73 62.39,31.69 61.05,30.34 v59.24,30.34
N$24
  Bottom 0.279: JP19.3 13.22,20.77 13.01,20.56 R44.1
N$25
  Top 0.279: T2.3 24.44,84.29 24.44,83.05 24.7,82.79 R35.2 C29.1
N$26  (via drill 0.38)
  Top 0.279: JP21.2 68.64,29.84 v68.89,30.09 | U2.7 58.04,29.13 v58.1,29.07
  Route15 0.272: v58.1,29.07 58.39,29.07 59.05,28.41 67.22,28.41 v68.89,30.09
N$28
  Top 0.279: C6.2 43.73,38.5 Y1.P$2 45.3,38.38 45.57,38.64 45.57,39.87 45.57,40.12 U4.1
N$29
  Top 0.279: C8.1 43.68,35.8 Y1.P$1 45.6,35.88 46.07,36.35 U4.2
N$32  (via drill 0.38)
  Top 0.279: 73.97,49.52 U8.P$4 74.74,48.83 | 74.74,48.83 74.86,48.83 74.86,49.14 | C21.2 81.27,47.42 v81.34,47.49 | 74.74,48.83 75.5,49.59 v75.5,50.03
  Route15 0.272: v75.5,50.03 78.04,47.49 v81.34,47.49
  pour Top (isolate 0.254, rank 2, no thermals): 73.47,54.6 73.47,48.89 74.74,48.89 74.86,48.76 76.01,48.76 76.77,51.55 78.8,51.55 78.8,56.58 75.24,56.58 75.24,54.6
N$33
  Top 0.279: U8.P$2 74.4,47.83 74.99,47.23 77.89,47.23 C21.1
N$34  (1 unrouted)
  Top 0.279: 73.98,47.31 73.98,46.73 73.97,46.73 76.01,44.95 77.97,44.95 C20.1
N$35  (via drill 0.38)
  Top 0.279: v77.02,54.96 77.05,54.98 R11.2 R10.1 | U8.P$6 72.93,51.02 v72.96,51.04
  Route15 0.272: v72.96,51.04 72.96,53.33 74.58,54.96 v77.02,54.96
N$36
  Top 0.279: U8.P$8 71.07,49.38 70.93,49.52
  pour Top: 72.96,50.79 72.96,54.2 70.16,54.2 70.16,49.27 71.18,49.27 71.18,50.79
N$37
  Top 0.279: U8.P$14 72.43,46.2 72.43,46.19 72.43,45.72 71.69,44.95 69.4,44.95 69.15,44.69 R15.1
N$38
  Top 0.279: C32.1 R38.2 59.22,13.59 T5.3
N$40
  Top 0.279: R5.1 R4.2 C13.1 56.57,44.9 U4.16
N$41
  Top 0.279: R19.1 63.81,47.74 | C27.1 63.9,47.65 63.81,47.74 | U9.P$5 62.8,48.44 62.8,48 63.05,47.74 63.81,47.74
N$42
  pour Top (no thermals): 63.31,64.76 63.31,66.28 60.26,66.28 60.26,64.76
N$44
  Top 0.279: T4.1 80.92,26.01 R41.1 80.92,30.3 81.58,30.96 Q4.1 81.59,31.54
N$45
  Top 0.279: U9.P$2 62.78,52.84 61.95,53.67 R22.2
N$46  (via drill 0.38)
  Top 0.279: U7.3 59.13,74.87 C25.1 v59.24,76.19 | R14.2 v52.13,76.19
  Route15 0.61: v59.24,76.19 57.72,77.71 53.65,77.71 v52.13,76.19
N$47
  Top 0.279: T5.1 61.44,9.39 R42.1 62.63,9.3 62.8,9.13 63.86,9.13 Q5.1
N$51
  Top 0.279: C24.1 58.48,73.74 58.48,72.38 58.48,71.62 U7.4
N$52
  Top 0.279: U7.2 59.78,75.2 60.51,75.94
  pour Top (no thermals): 61.02,79.24 61.02,75.94 60.51,75.94 60.51,76.95 58.48,76.95 58.48,79.24
N_ENAB_REG  (via drill 0.38)
  Top 0.279: U4.25 51.49,50.4 v51.94,50.85 | U7.7 55.46,71.09 v55.43,71.11
  Route15 0.272: v55.43,71.11 55.43,63.85 | 51.94,60.35 v51.94,50.85
  Route15 0.279: 55.43,63.85 51.94,60.35
PA12  (via drill 0.38)
  Top 0.279: U4.21 53.99,47.4 v54.01,47.39
  Route15 0.272: JP24.1 76.97,39.21 74.18,39.21 72.96,40.43 63.05,40.43 56.09,47.39 v54.01,47.39
PA15  (via drill 0.38)
  Top 0.279: U4.24 52.57,49.52 v53.32,49.91
PB02
  Top 0.279: U4.47 43.21,43.9 41.46,42.15 JP28.1
PB09  (via drill 0.38)
  Top 0.279: U4.8 49.07,40.9 50.1,39.87 50.61,39.87 v51.37,39.11
  Route15 0.272: v51.37,39.11 52.38,38.09 JP27.1
PB10  (via drill 0.38)
  Top 0.279: U4.19 51.45,46.4 v51.11,46.07
  Route15 0.272: JP26.1 64.83,37.53 56.91,45.46 51.72,45.46 v51.11,46.07
PB11  (via drill 0.38)
  Top 0.279: U4.20 51.44,46.9 v51.11,47.23
  Route15 0.272: v51.11,47.23 53.06,49.18 53.63,49.18 54.26,49.81 JP25.1
PGOOD
  Top 0.279: U7.6 57.18,72.16 56.96,72.38 56.28,73.05 R14.1
PWR_GND  (via drill 0.38)  (1 unrouted)
  Top 0.279: C25.2 v54.92,76.19
  pour Top (isolate 0.254, rank 3, no thermals): 63.56,66.79 57.46,66.79 57.46,64 51.88,64 51.88,58.66 49.84,58.66 49.84,68.97 arc-90 50.71,69.84 57.46,69.84 57.46,71.87 57.97,71.87 57.97,69.84 65.59,69.84 65.59,62.22 62.8,62.22 62.8,64.25 63.56,64.25
  pour Top (no thermals): 57.46,79.24 54.27,79.24 arc90 53.4,78.37 53.4,73.14 57.46,73.14 57.46,71.87 57.97,71.87 57.97,73.65 56.96,73.65 56.96,75.3 54.17,75.3 54.16,77.21 57.46,77.21
RF_IN
  Bottom 0.279: U10.4 19.03,30.02 U11.11
RF_NIRQ  (via drill 0.38)
  Top 0.279: U4.48 44.07,42.98 v43.75,42.66 | U1.NIRQ 22.21,34.46 v22.16,34.41
  Route15 0.272: v22.16,34.41 23.15,34.41 23.88,33.67 26.4,33.67 27.47,34.74 27.47,35.14 31.5,39.17 38.58,39.17 38.62,39.21 39.23,39.21 39.27,39.17 40.25,39.17 42.73,41.65 v43.75,42.66
RF_SDN  (via drill 0.38)
  Top 0.279: U4.28 49.57,51.57 v49.34,52.19 | U1.SDN 20.25,36.17 v20.25,34.41
  Route15 0.272: v49.34,52.19 47.15,49.75 45.5,49.75 45.5,49.52 44.51,48.53 44.51,46.84 41.82,44.15 41.82,44.01 41.39,43.58 41.38,43.58 41.06,43.26 39.43,43.26 38.25,44.44 29.78,44.44 20.25,34.92 v20.25,34.41
SPI_MISO  (via drill 0.38)
  Top 0.279: U1.SDO 30.21,34.56 v30.23,34.53 | U4.31 v48.07,49.01
  Route15 0.272: v48.07,49.01 48.07,47.12 45.49,44.54 45.49,42.92 43.95,41.45 42.43,39.92 40.22,37.72 30.9,37.72 30.23,37.02 v30.23,34.53
SPI_MOSI  (via drill 0.38)
  Top 0.279: U1.SDI 28.21,34.55 v28.2,34.53 | U4.30 48.57,49.52 v49.08,49.01
  Route15 0.272: v49.08,49.01 48.8,48.73 48.8,47.1 46.03,44.32 46.03,42.5 42.17,38.65 40.64,37.11 35.84,37.11 32.52,33.8 29.93,33.8 29.19,34.53 v28.2,34.53
SPI_SCK  (via drill 0.38)
  Top 0.279: U1.SCK 26.21,34.54 v26.22,34.53 | U4.32 47.57,49.53 v47.05,49.01
  Route15 0.272: v26.22,34.53 26.29,34.6 26.28,34.6 26.28,35.87 30.28,39.87 40.11,39.87 41.93,41.69 42.54,42.3 42.54,42.35 46.92,46.73 46.92,48.89 v47.05,49.01
SPI_SS  (via drill 0.38)
  Top 0.279: U4.41 45.47,46.9 v45.78,46.6 | U1.NSEL 24.21,34.43 v24.19,34.41
  Route15 0.272: v45.78,46.6 43.42,44.24 43.42,44.1 43.05,43.74 43.05,43.61 42.42,42.98 40.11,40.67 29.99,40.67 24.19,34.87 v24.19,34.41
SWCLK  (via drill 0.38)
  Top 0.279: v41.08,44.31 41.67,44.9 U4.45
  Route15 0.272: JP5.4 25.97,50.79 26.22,50.54 26.22,48 27.75,46.47 35.47,46.47 35.82,46.83 38.57,46.83 v41.08,44.31
SWDIO  (via drill 0.38)
  Top 0.279: U4.46 42.82,44.4 41.84,43.42 40.38,43.42 v39.81,43.99
  Route15 0.272: JP5.5 26.41,45.65 35.53,45.65 35.82,45.35 36.43,45.35 36.73,45.65 38.16,45.65 v39.81,43.99
UART1_RX  (via drill 0.38)
  Top 0.279: U4.27 50.07,52.79 v50.1,52.82
  Route15 0.272: v50.1,52.82 50.1,51.8 49.82,51.52 49.82,48.48 49.34,48 49.34,46.88 47.81,45.35 47.81,43.27 47.81,41.29 47.61,41.09 47.38,41.09 47.36,41.11 46.28,41.11 36.31,31.14 35.81,31.14 29.57,24.91 29.57,23.16 v29.57,21.48
  Bottom 0.279: U11.20 29.6,21.5 v29.57,21.48
UART1_TX  (via drill 0.38)  (1 unrouted)
  Top 0.279: U4.26 50.57,51.52 v51.11,52.06
  Route15 0.272: v51.11,52.06 50.35,51.3 50.35,48.26 49.87,47.78 49.87,45.58 | v32.78,20.41 31.81,21.38 31.81,24.12 45.7,38.01 46.16,38.01 46.49,38.34 46.49,38.54 48.78,40.83 48.78,44.11 49.87,45.2 49.87,45.58
  Bottom 0.279: U11.21 32.77,20.4 v32.78,20.41
USB_D_N  (via drill 0.38)
  Top 0.279: v47.43,86.48 47.45,87 47.44,87 47.44,87.49 | U4.33 47.07,53.56 v46.8,53.84 | 47.44,87.49 47.44,88.26 | J1.2 47.45,87.5 47.44,87.49
  Route15 0.272: v46.8,53.84 46.41,53.84 45.41,54.84 45.41,81.41 46.94,82.94 46.94,85.98 v47.43,86.48
USB_D_P  (via drill 0.38)
  Top 0.279: U4.34 46.57,52.54 v46.03,53.08 | v46.29,86.48 46.29,86.86 46.57,87.14 46.57,87.16 46.66,87.25 46.8,87.39 | 46.8,87.39 46.78,87.51 46.78,88.26 | J1.3 46.8,87.39
  Route15 0.272: v46.03,53.08 46.03,53.46 44.88,54.62 44.88,81.63 46.4,83.16 46.4,86.36 v46.29,86.48
USB_ID
  Top 0.279: J1.4 46.15,87.56 45.86,87.28 45.69,87.28 45.27,86.86 45.27,85.84 42.35,82.92 JP8.2
VBATT  (via drill 0.38)
  Top 0.279: R5.2 v59.75,49.52 | 66.29,56.7 v66.23,56.63
  Route15 0.272: v59.75,49.52 62.8,52.57 65.08,52.57 66.23,53.71 v66.23,56.63
  Route15 1.27: J2.PWR 49.83,14.94 80.79,14.94 83.75,17.9 83.75,60.06 80.58,63.24 80.54,63.2 JP12.1
  pour Top (isolate 0.254): 51.01,86.86 51.01,83.3 64.83,83.3 arc-90 66.1,82.03 66.1,57.39 62.8,57.39 62.8,55.87 66.35,55.87 66.35,54.85 73.21,54.75 73.34,59.68 73.34,60.82 79.94,60.82 79.94,63.49 83.63,63.49 83.63,65.4 83.37,85.59 arc90 82.1,86.86
  pour Route15 (no thermals): 80.45,61.71 80.45,65.14 77.53,65.14 77.53,68.82 80.45,68.82 80.45,72.25 77.4,72.25 77.4,75.43 70.16,75.43 70.16,72.25 74.1,72.25 74.1,65.14 70.16,65.14 70.16,61.71
VBURN1
  pour Top (no thermals): 16.57,91.94 19.36,91.94 19.36,85.59 16.57,85.59
VBURN2
  pour Top (rank 2, no thermals): 87.18,49.27 84.64,49.27 84.64,54.35 87.18,54.35
VBURN3
  pour Top (no thermals): 87.18,31.74 87.18,34.53 80.83,34.53 80.83,32.5 82.86,32.5 82.86,31.74
VBURN4
  pour Top (no thermals): 63.05,3.29 63.05,7.86 64.83,7.86 64.83,9.9 67.12,9.9 67.12,3.29
VBURN_IN  (3 unrouted)
  Top 0.279: R42.2 62.71,12.18 63.56,12.18
  pour Top (rank 2, no thermals): 23.94,85.08 23.94,82.54 20.63,82.54 20.63,81.52 16.57,81.52 16.57,85.08
  pour Top (no thermals): 82.86,54.35 85.15,54.35 85.15,60.95 84.13,60.95 84.13,60.32 81.98,60.32 81.98,58.92 81.09,58.92 81.09,57.39 82.86,57.39
  pour Top (no thermals): 77.53,27.68 80.07,27.68 80.07,30.22 80.32,30.22 80.32,35.55 76.01,35.55 76.01,30.47 77.53,30.47
  pour Top (no thermals): 67.88,10.4 60,10.4 60,12.94 62.8,12.94 62.8,14.21 67.12,14.21 67.12,12.94 67.88,12.94
VDDCORE3
  Top 0.279: U4.43 39.45,45.9 C10.1
VREG_IN
  pour Top (no thermals): 59.5,66.28 59.5,62.98 60.77,62.98 60.77,57.95 65.54,57.95 65.54,62.22 62.29,62.22 62.29,64.25 60,64.25 60,66.28
VSOLAR
  Top 0.279: 62.4,39.64 R7.2 62.44,39.68 U6.4
  pour Top (isolate 0.254, rank 3): 62.04,40.5 62.04,35.68 69.4,35.69 77.26,35.69 77.28,35.68 77.28,23.99 70.29,23.87 70.16,0.5 90.23,0.35 90.23,93.86 arc90 88.45,96 15.55,96 15.55,87.37 82.15,87.37 arc-90 83.88,85.63 83.88,39.11 80.32,39.11 79.05,40.5
  pour Top (isolate 0.254, rank 4): 15.81,87.37 8.81,87.37 arc90 7.17,85.73 7.17,47.59 arc-90 6.3,46.73 0.06,46.73 0.06,96 15.81,96
VSOLAR_IN
  Top 0.279: U8.P$3 76.18,48.33 76.26,48.25
  pour Top (isolate 0.254, rank 4): 79.56,45.71 76.01,45.71 74.99,46.73 74.99,51.55 79.31,51.55 79.31,56.63 83.37,56.63 83.37,39.36 79.56,39.36
WDT_!PFO  (via drill 0.38)
  Top 0.279: U4.29 49.07,51.41 49.08,51.43 48.45,51.93 v48.07,51.93 | U3.5 42.43,56.3 v42.48,56.25
  Route15 0.272: v42.48,56.25 45.3,53.43 45.3,52.77 46.14,51.93 v48.07,51.93
WDT_!RESET
  Top 0.279: U3.7 38.8,57.52 37.91,58.41 JP4.1
WDT_PFI
  Top 0.279: U3.4 41.34,49.77 41.49,49.62 42.28,49.62 42.99,48.9 U4.37
WDT_RESET
  Top 0.279: JP4.3 36.38,53.33 37.53,54.47 U3.8

### Text on the board
Top: KMB-20 | LYR 1
Route2: LYR 2
Route15: LYR 3
Bottom: KMB-20 | LYR 4
tNames: 3.3V | USB ID | GND | Rail / Switch | - | + | - | Batteries | + | JTAG | GND / / 3.3V / / !RST / / SWCLK / / SWDIO / / GND | !RST | PB11 | RST | PWR | WDT CONFIG | PB02 | PA12 | GPS / CON1 | IMU CONFIG | PB10 | CS_M | SDO_A/G | DAC_0 | DAC_0 | SDO_M | CS_A/G | GPS / CON2
bNames: GPS !RST | RFM23 / CONNECTOR
Document: Passive grid = 10mils / IC grid = 50 mils / Fanout grid = 2mil RFM,